# Altium project Hardware_Inventors_Course_Project.PrjPcb (part 1 of 2)
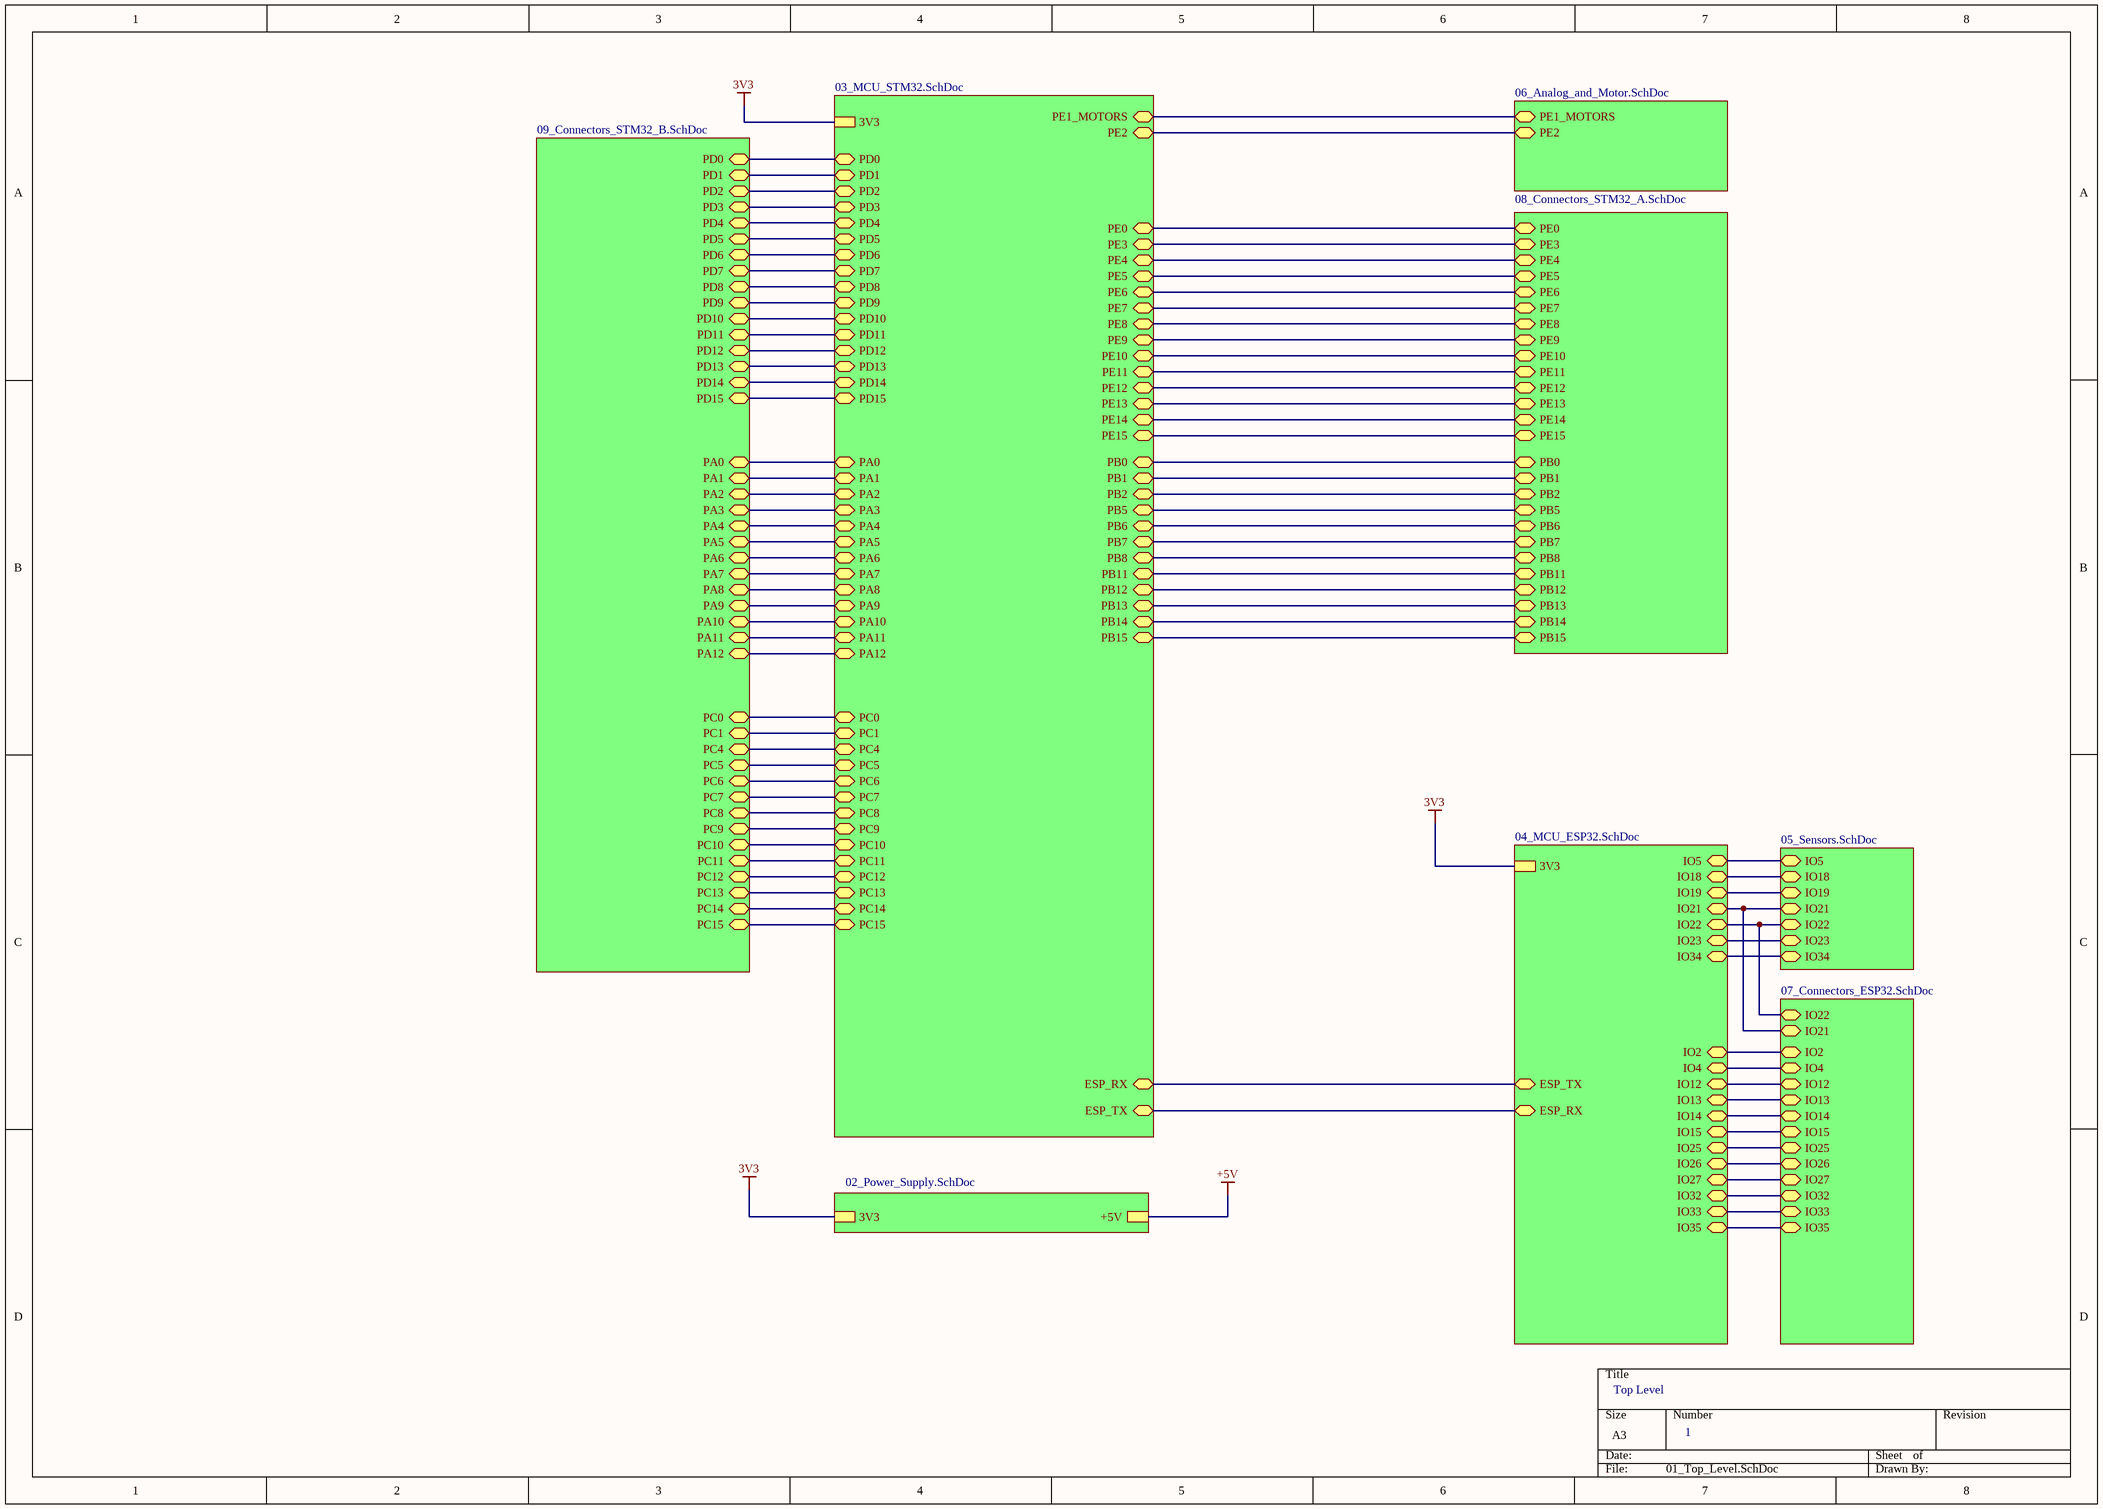
[diagram p0: 01_Top_Level.SchDoc]
9 sheets, 94 parts. Net scope: hierarchical (ports join the sheet entries above them; power ports are global).
Board file: Course_Project_PCB.PcbDoc
Sheets:
  01_Top_Level.SchDoc
    U_03_MCU_STM32 = 03_MCU_STM32.SchDoc
    U_02_Power_Supply = 02_Power_Supply.SchDoc
    U_04_MCU_ESP32 = 04_MCU_ESP32.SchDoc
    U_05_Sensors = 05_Sensors.SchDoc
    U_06_Analog_and_Motor = 06_Analog_and_Motor.SchDoc
    U_07_Connectors_ESP32 = 07_Connectors_ESP32.SchDoc
    U_08_Connectors_STM32_A = 08_Connectors_STM32_A.SchDoc
    U_09_Connectors_STM32_B = 09_Connectors_STM32_B.SchDoc

## Sheet 01_Top_Level.SchDoc
size A3; SheetNumber: 1; SheetTotal: 9

### Sub-sheets
U_02_Power_Supply = 02_Power_Supply.SchDoc: +5V, 3V3
U_03_MCU_STM32 = 03_MCU_STM32.SchDoc: 3V3, PE0 (bidir), PE1_MOTORS (bidir), PE2 (bidir), PE3 (bidir), PE4 (bidir), PE5 (bidir), PE6 (bidir), PE7 (bidir), PE8 (bidir), PE9 (bidir), PE10 (bidir), PE11 (bidir), PE12 (bidir), PE13 (bidir), PE14 (bidir), PE15 (bidir), PB15 (bidir), PB14 (bidir), PB13 (bidir), PB12 (bidir), PB11 (bidir), PB8 (bidir), PB7 (bidir), PB6 (bidir), PB5 (bidir), PB2 (bidir), PB1 (bidir), PB0 (bidir), PD1 (bidir), PD2 (bidir), PD3 (bidir), PD4 (bidir), PD5 (bidir), PD6 (bidir), PD7 (bidir), PD8 (bidir), PD9 (bidir), PD10 (bidir), PD11 (bidir), PD12 (bidir), PD13 (bidir), PD14 (bidir), PD15 (bidir), PD0 (bidir), PA0 (bidir), PA1 (bidir), PA2 (bidir), PA3 (bidir), PA4 (bidir), PA5 (bidir), PA6 (bidir), PA7 (bidir), PA8 (bidir), PA9 (bidir), PA10 (bidir), PA11 (bidir), PA12 (bidir), PC0 (bidir), PC1 (bidir), PC4 (bidir), PC5 (bidir), PC6 (bidir), PC7 (bidir), PC8 (bidir), PC9 (bidir), PC10 (bidir), PC11 (bidir), PC12 (bidir), PC13 (bidir), PC14 (bidir), PC15 (bidir), ESP_RX (bidir), ESP_TX (bidir)
U_04_MCU_ESP32 = 04_MCU_ESP32.SchDoc: IO2 (bidir), IO4 (bidir), IO5 (bidir), IO12 (bidir), IO13 (bidir), IO14 (bidir), IO15 (bidir), ESP_RX (bidir), ESP_TX (bidir), IO18 (bidir), IO19 (bidir), IO21 (bidir), IO22 (bidir), IO23 (bidir), IO25 (bidir), IO26 (bidir), IO27 (bidir), IO32 (bidir), IO33 (bidir), IO34 (bidir), IO35 (bidir), 3V3
U_05_Sensors = 05_Sensors.SchDoc: IO21 (bidir), IO22 (bidir), IO5 (bidir), IO18 (bidir), IO23 (bidir), IO19 (bidir), IO34 (bidir)
U_06_Analog_and_Motor = 06_Analog_and_Motor.SchDoc: PE1_MOTORS (bidir), PE2 (bidir)
U_07_Connectors_ESP32 = 07_Connectors_ESP32.SchDoc: IO22 (bidir), IO21 (bidir), IO2 (bidir), IO4 (bidir), IO12 (bidir), IO13 (bidir), IO14 (bidir), IO15 (bidir), IO25 (bidir), IO26 (bidir), IO27 (bidir), IO32 (bidir), IO33 (bidir), IO35 (bidir)
U_08_Connectors_STM32_A = 08_Connectors_STM32_A.SchDoc: PE0 (bidir), PE3 (bidir), PE4 (bidir), PE5 (bidir), PE6 (bidir), PE7 (bidir), PE8 (bidir), PE9 (bidir), PE10 (bidir), PE11 (bidir), PE12 (bidir), PE13 (bidir), PE14 (bidir), PE15 (bidir), PB0 (bidir), PB1 (bidir), PB2 (bidir), PB5 (bidir), PB6 (bidir), PB7 (bidir), PB8 (bidir), PB11 (bidir), PB12 (bidir), PB13 (bidir), PB14 (bidir), PB15 (bidir)
U_09_Connectors_STM32_B = 09_Connectors_STM32_B.SchDoc: PD0 (bidir), PD1 (bidir), PD2 (bidir), PD3 (bidir), PD4 (bidir), PD5 (bidir), PD6 (bidir), PD7 (bidir), PD8 (bidir), PD9 (bidir), PD10 (bidir), PD11 (bidir), PD12 (bidir), PD13 (bidir), PD14 (bidir), PD15 (bidir), PA0 (bidir), PA1 (bidir), PA2 (bidir), PA3 (bidir), PA4 (bidir), PA5 (bidir), PA6 (bidir), PA7 (bidir), PA8 (bidir), PA9 (bidir), PA10 (bidir), PA11 (bidir), PA12 (bidir), PC0 (bidir), PC1 (bidir), PC4 (bidir), PC6 (bidir), PC8 (bidir), PC5 (bidir), PC7 (bidir), PC9 (bidir), PC10 (bidir), PC11 (bidir), PC12 (bidir), PC13 (bidir), PC14 (bidir), PC15 (bidir)

### Nets
3V3: sheet U_03_MCU_STM32/3V3, sheet U_02_Power_Supply/3V3, sheet U_04_MCU_ESP32/3V3
PA0: sheet U_03_MCU_STM32/PA0, sheet U_09_Connectors_STM32_B/PA0
PA1: sheet U_03_MCU_STM32/PA1, sheet U_09_Connectors_STM32_B/PA1
PA2: sheet U_03_MCU_STM32/PA2, sheet U_03_MCU_STM32/ESP_RX, sheet U_04_MCU_ESP32/ESP_TX, sheet U_09_Connectors_STM32_B/PA2
PA3: sheet U_03_MCU_STM32/PA3, sheet U_03_MCU_STM32/ESP_TX, sheet U_04_MCU_ESP32/ESP_RX, sheet U_09_Connectors_STM32_B/PA3
PA4: sheet U_03_MCU_STM32/PA4, sheet U_09_Connectors_STM32_B/PA4
PA5: sheet U_03_MCU_STM32/PA5, sheet U_09_Connectors_STM32_B/PA5
PA6: sheet U_03_MCU_STM32/PA6, sheet U_09_Connectors_STM32_B/PA6
PA7: sheet U_03_MCU_STM32/PA7, sheet U_09_Connectors_STM32_B/PA7
PA8: sheet U_03_MCU_STM32/PA8, sheet U_09_Connectors_STM32_B/PA8
PA9: sheet U_03_MCU_STM32/PA9, sheet U_09_Connectors_STM32_B/PA9
PA10: sheet U_03_MCU_STM32/PA10, sheet U_09_Connectors_STM32_B/PA10
PA11: sheet U_03_MCU_STM32/PA11, sheet U_09_Connectors_STM32_B/PA11
PA12: sheet U_03_MCU_STM32/PA12, sheet U_09_Connectors_STM32_B/PA12
PB0: sheet U_03_MCU_STM32/PB0, sheet U_08_Connectors_STM32_A/PB0
PB1: sheet U_03_MCU_STM32/PB1, sheet U_08_Connectors_STM32_A/PB1
PB2: sheet U_03_MCU_STM32/PB2, sheet U_08_Connectors_STM32_A/PB2
PB5: sheet U_03_MCU_STM32/PB5, sheet U_08_Connectors_STM32_A/PB5
PB6: sheet U_03_MCU_STM32/PB6, sheet U_08_Connectors_STM32_A/PB6
PB7: sheet U_03_MCU_STM32/PB7, sheet U_08_Connectors_STM32_A/PB7
PB8: sheet U_03_MCU_STM32/PB8, sheet U_08_Connectors_STM32_A/PB8
PB11: sheet U_03_MCU_STM32/PB11, sheet U_08_Connectors_STM32_A/PB11
PB12: sheet U_03_MCU_STM32/PB12, sheet U_08_Connectors_STM32_A/PB12
PB13: sheet U_03_MCU_STM32/PB13, sheet U_08_Connectors_STM32_A/PB13
PB14: sheet U_03_MCU_STM32/PB14, sheet U_08_Connectors_STM32_A/PB14
PB15: sheet U_03_MCU_STM32/PB15, sheet U_08_Connectors_STM32_A/PB15
PC0: sheet U_03_MCU_STM32/PC0, sheet U_09_Connectors_STM32_B/PC0
PC1: sheet U_03_MCU_STM32/PC1, sheet U_09_Connectors_STM32_B/PC1
PC4: sheet U_03_MCU_STM32/PC4, sheet U_09_Connectors_STM32_B/PC4
PC5: sheet U_03_MCU_STM32/PC5, sheet U_09_Connectors_STM32_B/PC5
PC6: sheet U_03_MCU_STM32/PC6, sheet U_09_Connectors_STM32_B/PC6
PC7: sheet U_03_MCU_STM32/PC7, sheet U_09_Connectors_STM32_B/PC7
PC8: sheet U_03_MCU_STM32/PC8, sheet U_09_Connectors_STM32_B/PC8
PC9: sheet U_03_MCU_STM32/PC9, sheet U_09_Connectors_STM32_B/PC9
PC10: sheet U_03_MCU_STM32/PC10, sheet U_09_Connectors_STM32_B/PC10
PC11: sheet U_03_MCU_STM32/PC11, sheet U_09_Connectors_STM32_B/PC11
PC12: sheet U_03_MCU_STM32/PC12, sheet U_09_Connectors_STM32_B/PC12
PC13: sheet U_03_MCU_STM32/PC13, sheet U_09_Connectors_STM32_B/PC13
PC14: sheet U_03_MCU_STM32/PC14, sheet U_09_Connectors_STM32_B/PC14
PC15: sheet U_03_MCU_STM32/PC15, sheet U_09_Connectors_STM32_B/PC15
PD0: sheet U_03_MCU_STM32/PD0, sheet U_09_Connectors_STM32_B/PD0
PD1: sheet U_03_MCU_STM32/PD1, sheet U_09_Connectors_STM32_B/PD1
PD2: sheet U_03_MCU_STM32/PD2, sheet U_09_Connectors_STM32_B/PD2
PD3: sheet U_03_MCU_STM32/PD3, sheet U_09_Connectors_STM32_B/PD3
PD4: sheet U_03_MCU_STM32/PD4, sheet U_09_Connectors_STM32_B/PD4
PD5: sheet U_03_MCU_STM32/PD5, sheet U_09_Connectors_STM32_B/PD5
PD6: sheet U_03_MCU_STM32/PD6, sheet U_09_Connectors_STM32_B/PD6
PD7: sheet U_03_MCU_STM32/PD7, sheet U_09_Connectors_STM32_B/PD7
PD8: sheet U_03_MCU_STM32/PD8, sheet U_09_Connectors_STM32_B/PD8
PD9: sheet U_03_MCU_STM32/PD9, sheet U_09_Connectors_STM32_B/PD9
PD10: sheet U_03_MCU_STM32/PD10, sheet U_09_Connectors_STM32_B/PD10
PD11: sheet U_03_MCU_STM32/PD11, sheet U_09_Connectors_STM32_B/PD11
PD12: sheet U_03_MCU_STM32/PD12, sheet U_09_Connectors_STM32_B/PD12
PD13: sheet U_03_MCU_STM32/PD13, sheet U_09_Connectors_STM32_B/PD13
PD14: sheet U_03_MCU_STM32/PD14, sheet U_09_Connectors_STM32_B/PD14
PD15: sheet U_03_MCU_STM32/PD15, sheet U_09_Connectors_STM32_B/PD15
PE0: sheet U_03_MCU_STM32/PE0, sheet U_08_Connectors_STM32_A/PE0
PE1_MOTORS: sheet U_03_MCU_STM32/PE1_MOTORS, sheet U_06_Analog_and_Motor/PE1_MOTORS
PE2: sheet U_03_MCU_STM32/PE2, sheet U_06_Analog_and_Motor/PE2
PE3: sheet U_03_MCU_STM32/PE3, sheet U_08_Connectors_STM32_A/PE3
PE4: sheet U_03_MCU_STM32/PE4, sheet U_08_Connectors_STM32_A/PE4
PE5: sheet U_03_MCU_STM32/PE5, sheet U_08_Connectors_STM32_A/PE5
PE6: sheet U_03_MCU_STM32/PE6, sheet U_08_Connectors_STM32_A/PE6
PE7: sheet U_03_MCU_STM32/PE7, sheet U_08_Connectors_STM32_A/PE7
PE8: sheet U_03_MCU_STM32/PE8, sheet U_08_Connectors_STM32_A/PE8
PE9: sheet U_03_MCU_STM32/PE9, sheet U_08_Connectors_STM32_A/PE9
PE10: sheet U_03_MCU_STM32/PE10, sheet U_08_Connectors_STM32_A/PE10
PE11: sheet U_03_MCU_STM32/PE11, sheet U_08_Connectors_STM32_A/PE11
PE12: sheet U_03_MCU_STM32/PE12, sheet U_08_Connectors_STM32_A/PE12
PE13: sheet U_03_MCU_STM32/PE13, sheet U_08_Connectors_STM32_A/PE13
PE14: sheet U_03_MCU_STM32/PE14, sheet U_08_Connectors_STM32_A/PE14
PE15: sheet U_03_MCU_STM32/PE15, sheet U_08_Connectors_STM32_A/PE15
SCL: sheet U_04_MCU_ESP32/IO21, sheet U_05_Sensors/IO21, sheet U_07_Connectors_ESP32/IO21
SDA: sheet U_04_MCU_ESP32/IO22, sheet U_05_Sensors/IO22, sheet U_07_Connectors_ESP32/IO22
NetC31_2: sheet U_04_MCU_ESP32/IO34, sheet U_05_Sensors/IO34
NetJ3_3: sheet U_04_MCU_ESP32/IO2, sheet U_07_Connectors_ESP32/IO2
NetJ3_4: sheet U_04_MCU_ESP32/IO4, sheet U_07_Connectors_ESP32/IO4
NetJ3_5: sheet U_04_MCU_ESP32/IO12, sheet U_07_Connectors_ESP32/IO12
NetJ3_6: sheet U_04_MCU_ESP32/IO13, sheet U_07_Connectors_ESP32/IO13
NetJ3_7: sheet U_04_MCU_ESP32/IO14, sheet U_07_Connectors_ESP32/IO14
NetJ3_8: sheet U_04_MCU_ESP32/IO15, sheet U_07_Connectors_ESP32/IO15
NetJ3_9: sheet U_04_MCU_ESP32/IO25, sheet U_07_Connectors_ESP32/IO25
NetJ3_10: sheet U_04_MCU_ESP32/IO26, sheet U_07_Connectors_ESP32/IO26
NetJ3_11: sheet U_04_MCU_ESP32/IO27, sheet U_07_Connectors_ESP32/IO27
NetJ3_12: sheet U_04_MCU_ESP32/IO32, sheet U_07_Connectors_ESP32/IO32
NetJ3_13: sheet U_04_MCU_ESP32/IO33, sheet U_07_Connectors_ESP32/IO33
NetJ3_14: sheet U_04_MCU_ESP32/IO35, sheet U_07_Connectors_ESP32/IO35
NetMD1_29: sheet U_04_MCU_ESP32/IO5, sheet U_05_Sensors/IO5
NetMD1_30: sheet U_04_MCU_ESP32/IO18, sheet U_05_Sensors/IO18
NetMD1_31: sheet U_04_MCU_ESP32/IO19, sheet U_05_Sensors/IO19
NetMD1_37: sheet U_04_MCU_ESP32/IO23, sheet U_05_Sensors/IO23

### Notes on the sheet
- Top Level
- 1

## Sheet 03_MCU_STM32.SchDoc
size A3; SheetNumber: 3; SheetTotal: 9
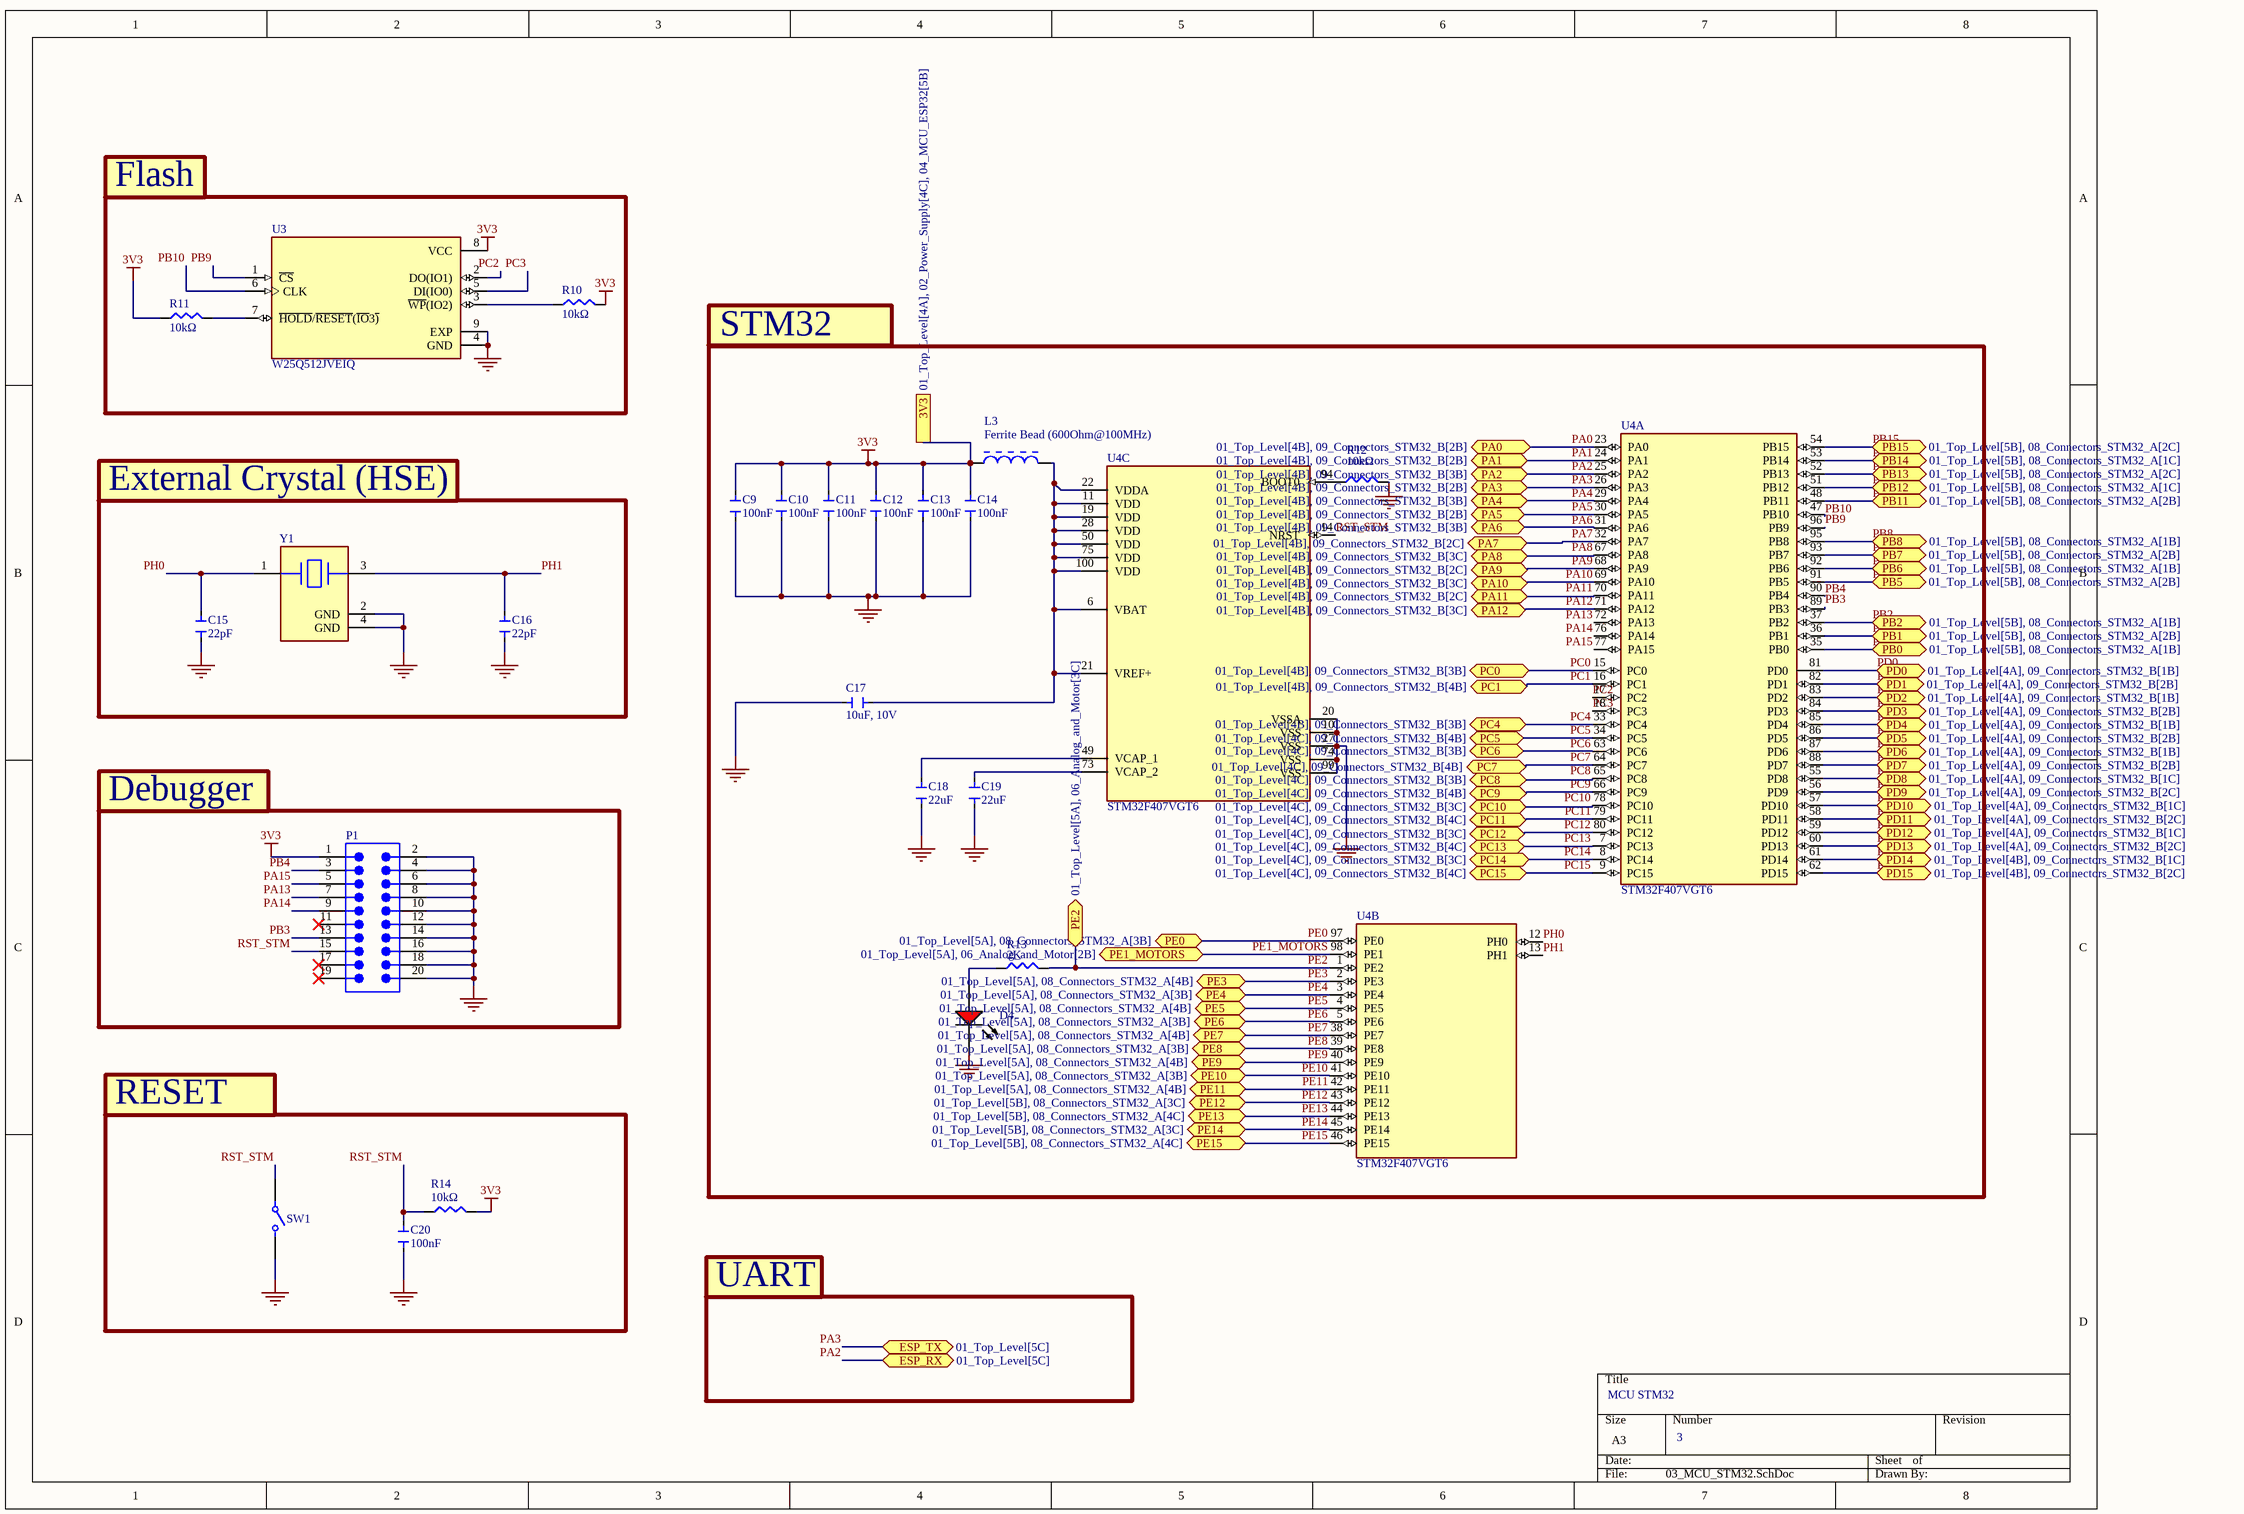
[diagram p1: 03_MCU_STM32.SchDoc]

### Parts
C9  100nF  [CAP_100nF]
C10  100nF  [CAP_100nF]
C11  100nF  [CAP_100nF]
C12  100nF  [CAP_100nF]
C13  100nF  [CAP_100nF]
C14  100nF  [CAP_100nF]
C15  22pF  [CAP_22uF]
C16  22pF  [CAP_22uF]
C17  10uF, 10V  [CAP_10uF]
C18  22uF  [CAP_22uF]
C19  22uF  [CAP_22uF]
C20  100nF  [CAP_100nF]
D4  304090041  [LED-2P-2.28-3MM_A]  (value not drawn)
L3  BLM18AG121SN1D  [MURA-BLM18-F-H1-CHIP-2_V]  (value not drawn)
P1  61002021121  [61002021121]  (value not drawn)
R10  10kΩ  [RES_10K]
R11  10kΩ  [RES_10K]
R12  10kΩ  [RES_10K]
R13  2K  [RES_2K]
R14  10kΩ  [RES_10K]
SW1  EVP-BD6C1A000  [FP-EVP-BD6C1A000-MFG]  (value not drawn)
U3  W25Q512JVEIQ  [SON127P600X800X80-9N]
U4  STM32F407VGT6  [QFP50P1600X1600X160-100N]  (parts A,B,C of 3)
Y1  ABM11AIG-32.000MHZ-4-T3  [FP-ABM11AIG-MFG]  (value not drawn)

### Blocks framed on the sheet
Flash: R10 R11 U3
STM32: C9-C14 C17-C19 D4 L3 R12 R13 U4
External Crystal (HSE): C15 C16 Y1
Debugger: P1
RESET: C20 R14 SW1

### Ports
3V3 (see 01_Top_Level[4A], 02_Power_Supply[4C], 04_MCU_ESP32[5B]), ESP_RX (bidir, see 01_Top_Level[5C]), ESP_TX (bidir, see 01_Top_Level[5C]), PA0 (bidir, see 01_Top_Level[4B], 09_Connectors_STM32_B[2B]), PA1 (bidir, see 01_Top_Level[4B], 09_Connectors_STM32_B[2B]), PA2 (bidir, see 01_Top_Level[4B], 09_Connectors_STM32_B[3B]), PA3 (bidir, see 01_Top_Level[4B], 09_Connectors_STM32_B[2B]), PA4 (bidir, see 01_Top_Level[4B], 09_Connectors_STM32_B[3B]), PA5 (bidir, see 01_Top_Level[4B], 09_Connectors_STM32_B[2B]), PA6 (bidir, see 01_Top_Level[4B], 09_Connectors_STM32_B[3B]), PA7 (bidir, see 01_Top_Level[4B], 09_Connectors_STM32_B[2C]), PA8 (bidir, see 01_Top_Level[4B], 09_Connectors_STM32_B[3C]), PA9 (bidir, see 01_Top_Level[4B], 09_Connectors_STM32_B[2C]), PA10 (bidir, see 01_Top_Level[4B], 09_Connectors_STM32_B[3C]), PA11 (bidir, see 01_Top_Level[4B], 09_Connectors_STM32_B[2C]), PA12 (bidir, see 01_Top_Level[4B], 09_Connectors_STM32_B[3C]), PB0 (bidir, see 01_Top_Level[5B], 08_Connectors_STM32_A[1B]), PB1 (bidir, see 01_Top_Level[5B], 08_Connectors_STM32_A[2B]), PB2 (bidir, see 01_Top_Level[5B], 08_Connectors_STM32_A[1B]), PB5 (bidir, see 01_Top_Level[5B], 08_Connectors_STM32_A[2B]), PB6 (bidir, see 01_Top_Level[5B], 08_Connectors_STM32_A[1B]), PB7 (bidir, see 01_Top_Level[5B], 08_Connectors_STM32_A[2B]), PB8 (bidir, see 01_Top_Level[5B], 08_Connectors_STM32_A[1B]), PB11 (bidir, see 01_Top_Level[5B], 08_Connectors_STM32_A[2B]), PB12 (bidir, see 01_Top_Level[5B], 08_Connectors_STM32_A[1C]), PB13 (bidir, see 01_Top_Level[5B], 08_Connectors_STM32_A[2C]), PB14 (bidir, see 01_Top_Level[5B], 08_Connectors_STM32_A[1C]), PB15 (bidir, see 01_Top_Level[5B], 08_Connectors_STM32_A[2C]), PC0 (bidir, see 01_Top_Level[4B], 09_Connectors_STM32_B[3B]), PC1 (bidir, see 01_Top_Level[4B], 09_Connectors_STM32_B[4B]), PC4 (bidir, see 01_Top_Level[4B], 09_Connectors_STM32_B[3B]), PC5 (bidir, see 01_Top_Level[4C], 09_Connectors_STM32_B[4B]), PC6 (bidir, see 01_Top_Level[4C], 09_Connectors_STM32_B[3B]), PC7 (bidir, see 01_Top_Level[4C], 09_Connectors_STM32_B[4B]), PC8 (bidir, see 01_Top_Level[4C], 09_Connectors_STM32_B[3B]), PC9 (bidir, see 01_Top_Level[4C], 09_Connectors_STM32_B[4B]), PC10 (bidir, see 01_Top_Level[4C], 09_Connectors_STM32_B[3C]), PC11 (bidir, see 01_Top_Level[4C], 09_Connectors_STM32_B[4C]), PC12 (bidir, see 01_Top_Level[4C], 09_Connectors_STM32_B[3C]), PC13 (bidir, see 01_Top_Level[4C], 09_Connectors_STM32_B[4C]), PC14 (bidir, see 01_Top_Level[4C], 09_Connectors_STM32_B[3C]), PC15 (bidir, see 01_Top_Level[4C], 09_Connectors_STM32_B[4C]), PD0 (bidir, see 01_Top_Level[4A], 09_Connectors_STM32_B[1B]), PD1 (bidir, see 01_Top_Level[4A], 09_Connectors_STM32_B[2B]), PD2 (bidir, see 01_Top_Level[4A], 09_Connectors_STM32_B[1B]), PD3 (bidir, see 01_Top_Level[4A], 09_Connectors_STM32_B[2B]), PD4 (bidir, see 01_Top_Level[4A], 09_Connectors_STM32_B[1B]), PD5 (bidir, see 01_Top_Level[4A], 09_Connectors_STM32_B[2B]), PD6 (bidir, see 01_Top_Level[4A], 09_Connectors_STM32_B[1B]), PD7 (bidir, see 01_Top_Level[4A], 09_Connectors_STM32_B[2B]), PD8 (bidir, see 01_Top_Level[4A], 09_Connectors_STM32_B[1C]), PD9 (bidir, see 01_Top_Level[4A], 09_Connectors_STM32_B[2C]), PD10 (bidir, see 01_Top_Level[4A], 09_Connectors_STM32_B[1C]), PD11 (bidir, see 01_Top_Level[4A], 09_Connectors_STM32_B[2C]), PD12 (bidir, see 01_Top_Level[4A], 09_Connectors_STM32_B[1C]), PD13 (bidir, see 01_Top_Level[4A], 09_Connectors_STM32_B[2C]), PD14 (bidir, see 01_Top_Level[4B], 09_Connectors_STM32_B[1C]), PD15 (bidir, see 01_Top_Level[4B], 09_Connectors_STM32_B[2C]), PE0 (bidir, see 01_Top_Level[5A], 08_Connectors_STM32_A[3B]), PE1_MOTORS (bidir, see 01_Top_Level[5A], 06_Analog_and_Motor[2B]), PE2 (bidir, see 01_Top_Level[5A], 06_Analog_and_Motor[3C]), PE3 (bidir, see 01_Top_Level[5A], 08_Connectors_STM32_A[4B]), PE4 (bidir, see 01_Top_Level[5A], 08_Connectors_STM32_A[3B]), PE5 (bidir, see 01_Top_Level[5A], 08_Connectors_STM32_A[4B]), PE6 (bidir, see 01_Top_Level[5A], 08_Connectors_STM32_A[3B]), PE7 (bidir, see 01_Top_Level[5A], 08_Connectors_STM32_A[4B]), PE8 (bidir, see 01_Top_Level[5A], 08_Connectors_STM32_A[3B]), PE9 (bidir, see 01_Top_Level[5A], 08_Connectors_STM32_A[4B]), PE10 (bidir, see 01_Top_Level[5A], 08_Connectors_STM32_A[3B]), PE11 (bidir, see 01_Top_Level[5A], 08_Connectors_STM32_A[4B]), PE12 (bidir, see 01_Top_Level[5B], 08_Connectors_STM32_A[3C]), PE13 (bidir, see 01_Top_Level[5B], 08_Connectors_STM32_A[4C]), PE14 (bidir, see 01_Top_Level[5B], 08_Connectors_STM32_A[3C]), PE15 (bidir, see 01_Top_Level[5B], 08_Connectors_STM32_A[4C])

### Nets
3V3: C9.2 C10.2 C11.2 C12.2 C13.2 C14.2 L3.1 P1.1 R10.2 R11.1 R14.2 U3.8(VCC) ; port 3V3
GND: C9.1 C10.1 C11.1 C12.1 C13.1 C14.1 C15.1 C16.1 C17.1 C18.2 C19.2 C20.1 D4.2(K) P1.2 P1.4 P1.6 P1.8 P1.10 P1.12 P1.14 P1.16 P1.18 P1.20 R12.2 SW1.B U3.4(GND) U3.9(EXP) U4.10(VSS) U4.20(VSSA) U4.27(VSS) U4.74(VSS) U4.99(VSS) Y1.2(GND) Y1.4(GND)
PA0: U4.23(PA0) ; port PA0
PA1: U4.24(PA1) ; port PA1
PA2: U4.25(PA2) ; port PA2, port ESP_RX
PA3: U4.26(PA3) ; port PA3, port ESP_TX
PA4: U4.29(PA4) ; port PA4
PA5: U4.30(PA5) ; port PA5
PA6: U4.31(PA6) ; port PA6
PA7: U4.32(PA7) ; port PA7
PA8: U4.67(PA8) ; port PA8
PA9: U4.68(PA9) ; port PA9
PA10: U4.69(PA10) ; port PA10
PA11: U4.70(PA11) ; port PA11
PA12: U4.71(PA12) ; port PA12
PA13: P1.7 U4.72(PA13)
PA14: P1.9 U4.76(PA14)
PA15: P1.5 U4.77(PA15)
PB0: U4.35(PB0) ; port PB0
PB1: U4.36(PB1) ; port PB1
PB2: U4.37(PB2) ; port PB2
PB3: P1.13 U4.89(PB3)
PB4: P1.3 U4.90(PB4)
PB5: U4.91(PB5) ; port PB5
PB6: U4.92(PB6) ; port PB6
PB7: U4.93(PB7) ; port PB7
PB8: U4.95(PB8) ; port PB8
PB9: U3.1(~{CS}) U4.96(PB9)
PB10: U3.6(CLK) U4.47(PB10)
PB11: U4.48(PB11) ; port PB11
PB12: U4.51(PB12) ; port PB12
PB13: U4.52(PB13) ; port PB13
PB14: U4.53(PB14) ; port PB14
PB15: U4.54(PB15) ; port PB15
PC0: U4.15(PC0) ; port PC0
PC1: U4.16(PC1) ; port PC1
PC2: U3.2(DO(IO1)) U4.17(PC2)
PC3: U3.5(DI(IO0)) U4.18(PC3)
PC4: U4.33(PC4) ; port PC4
PC5: U4.34(PC5) ; port PC5
PC6: U4.63(PC6) ; port PC6
PC7: U4.64(PC7) ; port PC7
PC8: U4.65(PC8) ; port PC8
PC9: U4.66(PC9) ; port PC9
PC10: U4.78(PC10) ; port PC10
PC11: U4.79(PC11) ; port PC11
PC12: U4.80(PC12) ; port PC12
PC13: U4.7(PC13) ; port PC13
PC14: U4.8(PC14) ; port PC14
PC15: U4.9(PC15) ; port PC15
PD0: U4.81(PD0) ; port PD0
PD1: U4.82(PD1) ; port PD1
PD2: U4.83(PD2) ; port PD2
PD3: U4.84(PD3) ; port PD3
PD4: U4.85(PD4) ; port PD4
PD5: U4.86(PD5) ; port PD5
PD6: U4.87(PD6) ; port PD6
PD7: U4.88(PD7) ; port PD7
PD8: U4.55(PD8) ; port PD8
PD9: U4.56(PD9) ; port PD9
PD10: U4.57(PD10) ; port PD10
PD11: U4.58(PD11) ; port PD11
PD12: U4.59(PD12) ; port PD12
PD13: U4.60(PD13) ; port PD13
PD14: U4.61(PD14) ; port PD14
PD15: U4.62(PD15) ; port PD15
PE0: U4.97(PE0) ; port PE0
PE1_MOTORS: U4.98(PE1) ; port PE1_MOTORS
PE2: R13.2 U4.1(PE2) ; port PE2
PE3: U4.2(PE3) ; port PE3
PE4: U4.3(PE4) ; port PE4
PE5: U4.4(PE5) ; port PE5
PE6: U4.5(PE6) ; port PE6
PE7: U4.38(PE7) ; port PE7
PE8: U4.39(PE8) ; port PE8
PE9: U4.40(PE9) ; port PE9
PE10: U4.41(PE10) ; port PE10
PE11: U4.42(PE11) ; port PE11
PE12: U4.43(PE12) ; port PE12
PE13: U4.44(PE13) ; port PE13
PE14: U4.45(PE14) ; port PE14
PE15: U4.46(PE15) ; port PE15
PH0: C15.2 U4.12(PH0) Y1.1(1_Crystal)
PH1: C16.2 U4.13(PH1) Y1.3(2_Crystal)
RST_STM: C20.2 P1.15 R14.1 SW1.A U4.14(NRST)
NetC17_2: C17.2 L3.2 U4.6(VBAT) U4.11(VDD) U4.19(VDD) U4.21(VREF+) U4.22(VDDA) U4.28(VDD) U4.50(VDD) U4.75(VDD) U4.100(VDD)
NetC18_1: C18.1 U4.49(VCAP_1)
NetC19_1: C19.1 U4.73(VCAP_2)
NetD4_1: D4.1(A) R13.1
NetR10_1: R10.1 U3.3(~{WP}(IO2))
NetR11_2: R11.2 U3.7(~{HOLD}/~{RESET}(~{IO}3~{)})
NetR12_1: R12.1 U4.94(BOOT0)

Not connected (* = marked no-connect by the designer): P1 11* 17* 19*

### Notes on the sheet
- (near L3) Ferrite Bead (600Ohm@100MHz)
- UART
- MCU STM32
- 3

### Library data of the parts
C9-C14 C20 = CAP_100nF: CAP 100nF 50V X7R ±10% 0603 Ceramic Capacitors RoHS; manufacturer: YAGEO; manufacturer part number: CC0603KRX7R9BB104; value: 100nf; supplier: LCSC; supplier part number: C14663; ComponentLink1Description: Datasheet; ComponentLink1URL: https://www.lcsc.com/datasheet/C14663.pdf
C15 C16 C18 C19 = CAP_22uF: CAP 22uF 25V X5R ±20% 0805 Ceramic Capacitors RoHS; manufacturer: Samsung Electro-Mechanics; manufacturer part number: CL21A226MAYNNNE; ComponentLink1Description: Datasheet; ComponentLink1URL: https://www.lcsc.com/datasheet/C602037.pdf; Value: 22uF; supplier: LCSC; supplier part number: C602037
C17 = CAP_0402_10UF: CAP CER 10UF 10V X5R 0402; Manufacturer: Samsung Electro-Mechanics; Manufacturer Part Number: C307415; Dielectric Material: Ceramic; Multilayer: Yes; Tolerance  (fill in as +-): 20%; Supplier: LCSC; Supplier Part Number: 1276-6830-1-ND; RoHS: Yes; Category: Ceramic Capacitors; Stock: 1294909; Pricing: 1=0.33, 10=0.215, 50=0.1584, 100=0.129, 500=0.1018, 1000=0.08597, 2500=0.08145 (USD); Mounting Technology: Surface Mount; Pins: 2; Package Shape: Rectangular; Case/Package: 0402; Terminal Finish: Nickel; Min Operating Temperature: -55°C; Max Operating Temperature: 85°C; JESD-609 Code: e3; Value: 10uF; Capacitor Type: Ceramic; Packaging: Tape and Reel; Tolerance (fill in as +-): 20%; Rated DC Voltage (URdc): 10V; Temperature Characteristics Code: X5R; Termination: Wraparound; Reach SVHC Compliant: Yes; RoHS Compliant: Yes; ComponentLink1URL: https://datasheet.ciiva.com:443/pdfs/VipMasterIC/IC/SEMS/SEMS-S-A0008521219/SEMS-S-A0008521325-1.pdf?src-supplier=IHS+Markit; ComponentLink1Description: https://datasheet.ciiva.com:443/pdfs/VipMasterIC/IC/SEMS/SEMS-S-A0008521219/SEMS-S-A0008521325-1.pdf?src-supplier=IHS+Markit; ComponentLink2URL: http://www.samsungsem.com/kr/support/product-search/mlcc/CL05A106MP8NUB8.jsp?src-supplier=Digikey; ComponentLink2Description: http://www.samsungsem.com/kr/support/product-search/mlcc/CL05A106MP8NUB8.jsp?src-supplier=Digikey; ComponentLink3URL: https://datasheet.octopart.com/CL05A106MP8NUB8-Samsung-Electro-Mechanics-datasheet-136460857.pdf?src-supplier=Future+Electronics; ComponentLink3Description: https://datasheet.octopart.com/CL05A106MP8NUB8-Samsung-Electro-Mechanics-datasheet-136460857.pdf?src-supplier=Future+Electronics; LCSC Part Number: C307415
D4 = CMP-007-00007-2: Red LED, 80 mW, 30 mA, -25 to 85 degC, 2-Pin THD; Manufacturer: Shenzhen CGX; Package Description: 2-Pin Through Hole Device, Dia 3 mm, Pitch 2.28 mm; Datasheet URL: http://datasheet.octopart.com/304090041-Chengguangxing-datasheet-62330656.pdf; Mounting Technology: TH; Manufacturer URL: http://szcgx.com/; RoHS Compliant: Unknown; Datasheet Version: Sep-14; Case/Package: 304090041; Package Reference: 304090041
L3 = CMP-006-00004-3: Chip Ferrite Bead for General Use, 120 Ohm, 500 mA, -55 to 125 degC, 0603 (1608 Metric), RoHS, Tape and Reel; Manufacturer: Murata; Max Current Rating: 500mA; Tolerance: 25%; Impedance: 120Ohm; Resistance: 200mohm; Min Operating Temperature: -55°C; Package Reference: BLM18_H950-2; Max Operating Temperature: 125°C; Current Rating: 500mA; Core Material: Ferrite; Datasheet Version: Jun-12; Packaging: TapeandReel; Datasheet URL: https://statics3.seeedstudio.com/images/opl/datasheet/303010016.pdf; Package Quantity: 4000; Case/Package: 0603; RoHS Compliant: True
P1 = CMP-1502-01036-4: SMT Vertical Pin Header WR-PHD, Pitch 2.54 mm, Dual Row, 20 pins; Number of Positions: 20; Connector Type: Male Pin; Row Spacing: 2.54mm; Voltage Rating: 250V; Contact Resistance: 20mΩ; Current Rating: 3A; Gender: Male; Mount: Surface Mount; Max Operating Temperature: 105°C; Number of Rows: 2; Orientation: Vertical; Contact Plating: Gold; Lead Pitch: 2.54mm; Pitch: 2.54mm; Min Operating Temperature: -40°C; RoHS: Compliant; Color: Black; Operating Supply Voltage: 250V; Termination: Solder; Number of Contacts: 20; Contact Mating Length: 5.9944mm; Height: 10mm; Number of Pins: 20; Contact Material: Gold
R10-R12 R14 = RES_0603_10K: 100mW Thin Film Resistor ±0.1% ±10ppm/℃ 10kΩ 0603 Chip Resistor - Surface Mount ROHS; Manufacturer: Yageo Group; Manufacturer Part Number: RT0603BRB07169KL; Manufacturer: YAGEO; Temperature Coefficient: 10ppm/°C; Voltage Rating: 75V; Features: Moisture Resistant; Height: 450µm; Length: 1.6002mm; Lifecycle Status: Production; Max Operating Temperature: 155°C; Max Power Dissipation: 100mW; Min Operating Temperature: -55°C; Mounting Technology: Surface Mount; Number of Terminals: 2; Number of Terminations: 2; Packaging: Tape & Reel; Power Dissipation: 100mW; Power Rating: 100mW; REACH SVHC: Yes; Tolerance: 0.1%; Width: 800µm; Working Voltage: 75V; ComponentLink1URL: https://datasheet.octopart.com:443/RT0603BRB07169KL-Yageo-datasheet-176402239.pdf?src-supplier=IHS; ComponentLink1Description: https://datasheet.octopart.com:443/RT0603BRB07169KL-Yageo-datasheet-176402239.pdf?src-supplier=IHS; ComponentLink2URL: https://datasheet.octopart.com:443/RT0603BRB07169KL-Yageo-datasheet-96443642.pdf?src-supplier=Upverter; ComponentLink2Description: https://datasheet.octopart.com:443/RT0603BRB07169KL-Yageo-datasheet-96443642.pdf?src-supplier=Upverter; ComponentLink3URL: https://datasheet.octopart.com:443/RT0603BRB07169KL-Yageo-Group-datasheet-141265893.pdf?src-supplier=ODG+(Origin+Data+Global); ComponentLink3Description: https://datasheet.octopart.com:443/RT0603BRB07169KL-Yageo-Group-datasheet-141265893.pdf?src-supplier=ODG+(Origin+Data+Global); ComponentLink4URL: https://datasheet.octopart.com/RT0603BRB07169KL-Yageo-datasheet-86813807.pdf; ComponentLink4Description: https://datasheet.octopart.com/RT0603BRB07169KL-Yageo-datasheet-86813807.pdf; ComponentLink5URL: http://sigma.octopart.com:80/conflict_mineral_statement/Yageo-company-3.pdf?src-supplier=Compliance+Statements; ComponentLink5Description: http://sigma.octopart.com:80/conflict_mineral_statement/Yageo-company-3.pdf?src-supplier=Compliance+Statements; ComponentLink6URL: http://sigma.octopart.com:80/rohs_statement/Yageo-company-2.pdf?src-supplier=Compliance+Statements; ComponentLink6Description: http://sigma.octopart.com:80/rohs_statement/Yageo-company-2.pdf?src-supplier=Compliance+Statements; Supplier: LCSC; Supplier Part Number: C860143; Datasheet Link: https://www.lcsc.com/datasheet/C860143.pdf
R13 = RSE_0603_2K: 100mW 2KΩ 75V Thick Film Resistor ±100ppm/℃ ±1% 0603 Chip Resistor - Surface Mount RoHS; ComponentLink1Description: datasheet; ComponentLink1URL: https://www.lcsc.com/product-detail/C105588.html?s_z=n_resistance%2520100%2520ohm
SW1 = CMP-00287-74573419-1: EVP-BD6C1A000 Switch Tactile N.O. SPST Round Button J-Bend 0.05A 12VDC 3.5N SMD Automotive T/R; Contact Current Rating: 20mA; Life (Cycles): 100kcycles; Contact Resistance: 500mΩ; Voltage Rating (DC): 15V; Number of Positions: 2; Max Operating Temperature: 90°C; NexarPartId: 74573419; RoHS: Non-Compliant; Min Operating Temperature: -40°C; Height: 4.2mm; Operating Force: 3.5N; Mount: Surface Mount
U3 = W25Q512JVEIQ: FLASH - NOR Memory IC 512Mb (64M x 8) SPI - Quad I/O 133 MHz 8-WSON (8x6); MF: Winbond Electronics; SnapEDA_Link: https://www.snapeda.com/parts/W25Q512JVEIQ/Winbond/view-part/?ref=snap; Package: Package; Value: *; MP: W25Q512JVEIQ; Check_prices: https://www.snapeda.com/parts/W25Q512JVEIQ/Winbond/view-part/?ref=eda
U4 = STM32F407VGT6: ARMÂ® CortexÂ®-M4 STM32F4 Microcontroller IC 32-Bit Single-Core 168MHz 1MB (1M x 8) FLASH 100-LQFP (14x14); MF: STMicroelectronics; SnapEDA_Link: https://www.snapeda.com/parts/STM32F407VGT6/STMicroelectronics/view-part/?ref=snap; Package: LQFP-100 STMicroelectronics; Value: *; MP: STM32F407VGT6; Check_prices: https://www.snapeda.com/parts/STM32F407VGT6/STMicroelectronics/view-part/?ref=eda
Y1 = CMP-27762-011048-1: Crystal 32MHz ±30ppm 10pF SMD-4 2.5mm x 2mm Automotive; Frequency Stability: 100ppm; ESR (Equivalent Series Resistance): 80R; Max Operating Temperature: 125°C; Frequency Tolerance: 30ppm; Length: 0.098inch; Frequency: 32MHz; RoHS Compliant: Yes; Min Operating Temperature: -40°C; Width: 0.079inch; Load Capacitance: 10pF; Packaging: Tape and Reel; Height: 0.024inch; Mount: Surface Mount; Case/Package: SMD/SMT; Ratings: AEC-Q200

## Sheet 02_Power_Supply.SchDoc
size A4; SheetNumber: 2; SheetTotal: 9
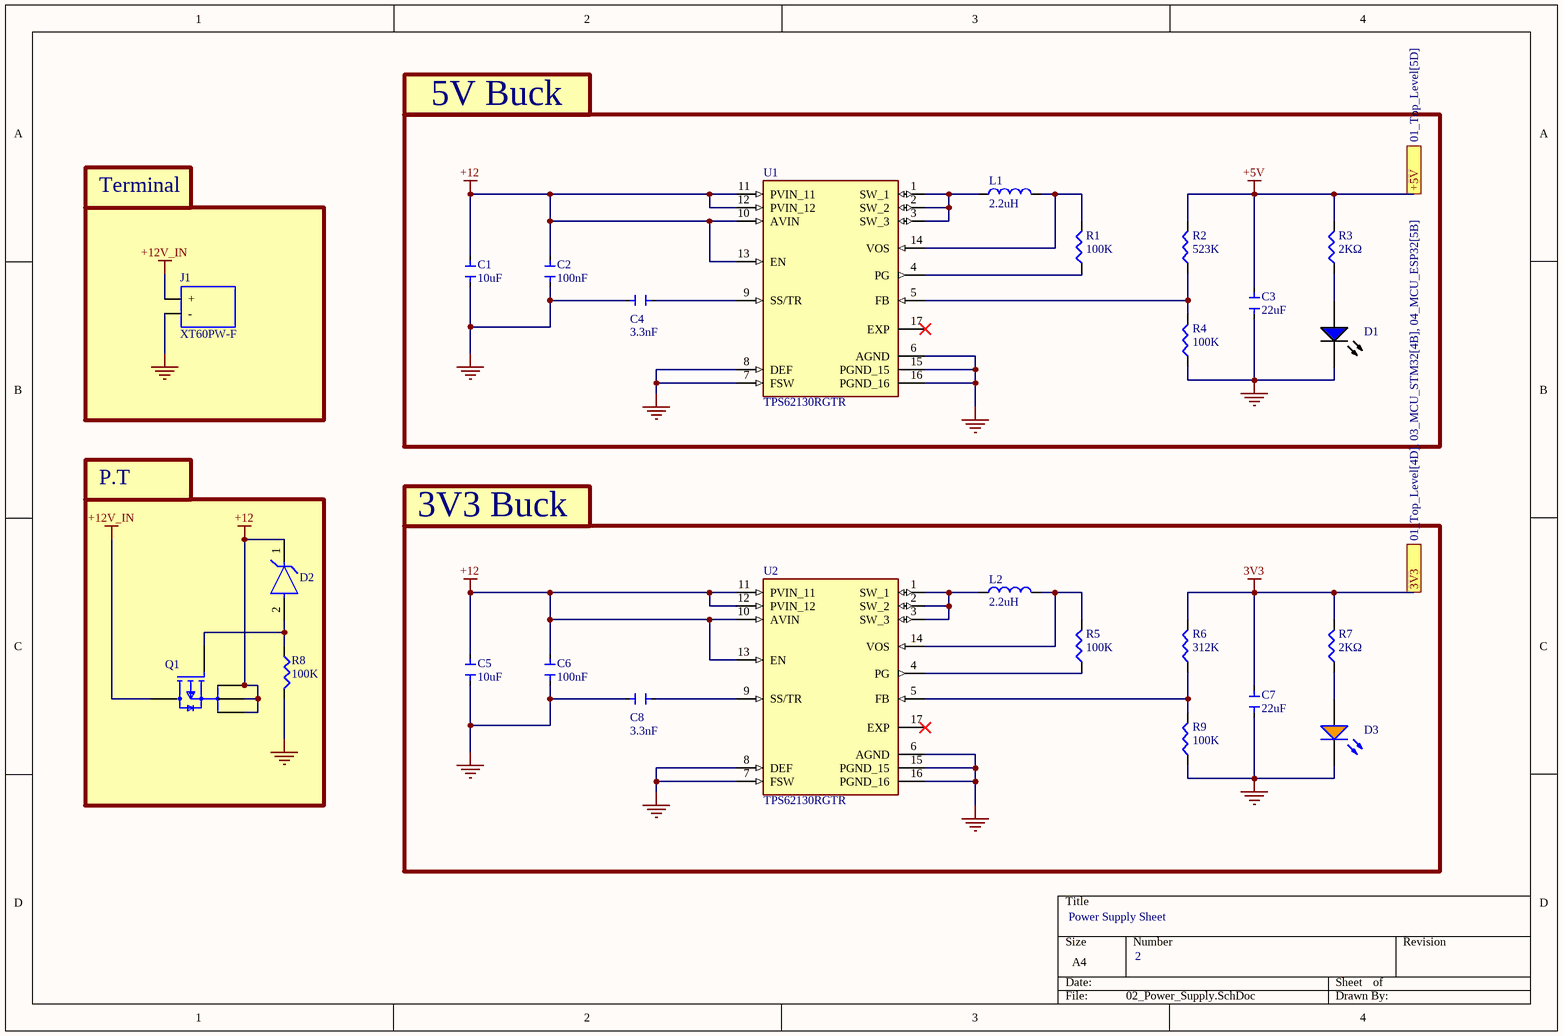
[diagram p2: 02_Power_Supply.SchDoc]

### Parts
C1  10uF  [CAP_10uF]
C2  100nF  [CAP_100nF]
C3  22uF  [CAP_22uF]
C4  3.3nF  [CAP_0603_0.33uF]
C5  10uF  [CAP_10uF]
C6  100nF  [CAP_100nF]
C7  22uF  [CAP_22uF]
C8  3.3nF  [CAP_0603_0.33uF]
D1  HSMR-C190  [AVAG-HSMX-C190_V]  (value not drawn)
D2  SMAZ15-13-F  [FP-SMA-MFG]  (value not drawn)
D3  HSMD-C190  [AVAG-HSMX-C190_V]  (value not drawn)
J1  XT60PW-F  [XT60PW-F]
L1  2.2uH  [IND_2.2uH]
L2  2.2uH  [IND_2.2uH]
Q1  SQJ431AEP-T1_GE3  [FP-S19-0643-SINGLE-MFG]  (value not drawn)
R1  100K  [RES_100K]
R2  523K  [RES_523K]
R3  2KΩ  [RES_312K]
R4  100K  [RES_100K]
R5  100K  [RES_100K]
R6  312K  [RES_523K]
R7  2KΩ  [RES_312K]
R8  100K  [RES_100K]
R9  100K  [RES_100K]
U1  TPS62130RGTR  [QFN50P300X300X100-17N]
U2  TPS62130RGTR  [QFN50P300X300X100-17N]

### Blocks framed on the sheet
5V Buck: C1-C4 D1 L1 R1-R4 U1
Terminal: J1
P.T: D2 Q1 R8
3V3 Buck: C5-C8 D3 L2 R5-R7 R9 U2

### Ports
3V3 (see 01_Top_Level[4D], 03_MCU_STM32[4B], 04_MCU_ESP32[5B]), +5V (see 01_Top_Level[5D])

### Nets
3V3: C7.2 R6.2 R7.2 ; port 3V3
+5V: C3.2 R2.2 R3.2 ; port +5V
+12: C1.2 C2.2 C5.2 C6.2 D2.1(C) Q1.1(S) Q1.2(S) Q1.3(S) U1.10(AVIN) U1.11(PVIN_11) U1.12(PVIN_12) U1.13(EN) U2.10(AVIN) U2.11(PVIN_11) U2.12(PVIN_12) U2.13(EN)
+12V_IN: J1.1(+) Q1.5-6-7-8(D)
GND: C1.1 C2.1 C3.1 C4.2 C5.1 C6.1 C7.1 C8.2 D1.2(K) D3.2(K) J1.2(-) R4.1 R8.2 R9.1 U1.6(AGND) U1.7(FSW) U1.8(DEF) U1.15(PGND_15) U1.16(PGND_16) U2.6(AGND) U2.7(FSW) U2.8(DEF) U2.15(PGND_15) U2.16(PGND_16)
NetC4_1: C4.1 U1.9(SS/TR)
NetC8_1: C8.1 U2.9(SS/TR)
NetD1_1: D1.1(A) R3.1
NetD2_2: D2.2(A) Q1.4(G) R8.1
NetD3_1: D3.1(A) R7.1
NetL1_1: L1.1 U1.1(SW_1) U1.2(SW_2) U1.3(SW_3)
NetL1_2: L1.2 R1.2 U1.14(VOS)
NetL2_1: L2.1 U2.1(SW_1) U2.2(SW_2) U2.3(SW_3)
NetL2_2: L2.2 R5.2 U2.14(VOS)
NetR1_1: R1.1 U1.4(PG)
NetR2_1: R2.1 R4.2 U1.5(FB)
NetR5_1: R5.1 U2.4(PG)
NetR6_1: R6.1 R9.2 U2.5(FB)

Not connected (* = marked no-connect by the designer): U1 17(EXP)*; U2 17(EXP)*

### Notes on the sheet
- Power Supply Sheet
- 2

### Library data of the parts
C1 C5 = CAP_0402_10UF: as C17 on sheet 03_MCU_STM32; Supplier: LCSC; Supplier Part Number: 1276-6830-1-ND; RoHS: Yes; Category: Ceramic Capacitors; Stock: 1294909; Pricing: 1=0.33, 10=0.215, 50=0.1584, 100=0.129, 500=0.1018, 1000=0.08597, 2500=0.08145 (USD); Mounting Technology: Surface Mount; Pins: 2; Package Shape: Rectangular; Case/Package: 0402; Terminal Finish: Nickel; Min Operating Temperature: -55°C; Max Operating Temperature: 85°C; JESD-609 Code: e3; Value: 10uF; Capacitor Type: Ceramic; Packaging: Tape and Reel; Tolerance (fill in as +-): 20%; Rated DC Voltage (URdc): 10V; Temperature Characteristics Code: X5R; Termination: Wraparound; Reach SVHC Compliant: Yes; RoHS Compliant: Yes; ComponentLink1URL: https://datasheet.ciiva.com:443/pdfs/VipMasterIC/IC/SEMS/SEMS-S-A0008521219/SEMS-S-A0008521325-1.pdf?src-supplier=IHS+Markit; ComponentLink1Description: https://datasheet.ciiva.com:443/pdfs/VipMasterIC/IC/SEMS/SEMS-S-A0008521219/SEMS-S-A0008521325-1.pdf?src-supplier=IHS+Markit; ComponentLink2URL: http://www.samsungsem.com/kr/support/product-search/mlcc/CL05A106MP8NUB8.jsp?src-supplier=Digikey; ComponentLink2Description: http://www.samsungsem.com/kr/support/product-search/mlcc/CL05A106MP8NUB8.jsp?src-supplier=Digikey; ComponentLink3URL: https://datasheet.octopart.com/CL05A106MP8NUB8-Samsung-Electro-Mechanics-datasheet-136460857.pdf?src-supplier=Future+Electronics; ComponentLink3Description: https://datasheet.octopart.com/CL05A106MP8NUB8-Samsung-Electro-Mechanics-datasheet-136460857.pdf?src-supplier=Future+Electronics; LCSC Part Number: C307415
C2 C6 = CAP_100nF: as C9 on sheet 03_MCU_STM32; value: 100nf; supplier: LCSC; supplier part number: C14663; ComponentLink1Description: Datasheet; ComponentLink1URL: https://www.lcsc.com/datasheet/C14663.pdf
C3 C7 = CAP_22uF: as C15 on sheet 03_MCU_STM32; ComponentLink1Description: Datasheet; ComponentLink1URL: https://www.lcsc.com/datasheet/C602037.pdf; Value: 22uF; supplier: LCSC; supplier part number: C602037
C4 C8 = CAP_0603_0.33uF
D1 = CMP-007-00015-2: LED Uni-Color Blue, 78 mW, 20 mA, -40 to 85 degC, 2-Pin SMD, RoHS, Tape and Reel; Manufacturer: Avago; Forward Voltage: 3.4V; Power: 78mW; Forward Current: 20mA; Luminous Intensity: 55mcd; Lens Style: Diffused; Viewing Angle: 155degrees; Pins: 2; Max Operating Temperature: 85°C; Colour: Blue; Datasheet Version: Apr-10; RoHS Compliant: True; Mounting Technology: SM; Min Operating Temperature: -40°C; Illumination Colour: Blue; Package Quantity: 4000; Datasheet URL: http://docs.avagotech.com/docs/AV02-0977EN; Package Reference: HSMX-C190; Packaging: TapeandReel; Nominal Vf: 3.4V; Case/Package: 0603; Package Description: 2-Pin Surface Mount Device, Body 1.6 x 0.8 mm, Height 0.9 mm; Manufacturer URL: http://www.avagotech.com/
D2 = CMP-12792-000022-1: DIODE ZENER 15V 1W SMA; Manufacturer: Diodes; Forward Current: 200mA; Max Reverse Leakage Current: 1uA; Max Junction Temp: +150°C; Standoff Height: 0.05mm; Reverse Voltage: 11.4V; Zener Impedance: 10Ω; Max Zener Voltage: 15.75V; ComponentLink2URL: https://www.diodes.com/assets/Datasheets/ds18015.pdf; ComponentLink2Description: Datasheet; Nom Zener Voltage: 15V; Category: Diode; Device Class L2: Diodes; Lead Free: Yes; Power Dissipation: 1W; Automotive: No; Octopart: https://octopart.com/smaz15-13-f-diodes+inc.-334038; Temperature Range Low: -65°C; Temperature Range High: +150°C; Package: SMA; Temperature: -65°C to +150°C; Digikey Description: DIODE ZENER 15V 1W SMA; Manufacturer Part Number: SMAZ15-13-F; Mouser Description: Zener Diodes 15V 1W; Footprint Url: https://www.diodes.com/assets/Package-Files/SMA.pdf; Device Class L3: Zener Diodes; RoHS: TRUE; Device Class L1: Discrete Semiconductors; Height: 2.4mm
D3 = CMP-007-00012-2: LED Uni-Color Orange, 52 mW, 20 mA, -40 to 85 degC, 2-Pin SMD, RoHS, Tape and Reel; Manufacturer: Avago; Lens Style: Diffused; Forward Voltage: 2.2V; Forward Current: 20mA; Viewing Angle: 170degrees; Power: 52mW; Luminous Intensity: 8mcd; Min Operating Temperature: -40°C; Packaging: TapeandReel; Colour: Orange; Nominal Vf: 2.2V; Pins: 2; Case/Package: 0603; Max Operating Temperature: 85°C; Illumination Colour: Orange; Package Description: 2-Pin Surface Mount Device, Body 1.6 x 0.8 mm, Height 0.9 mm; Manufacturer URL: http://www.avagotech.com/; Datasheet Version: Mar-12; RoHS Compliant: True; Datasheet URL: http://docs.avagotech.com/docs/AV02-0551EN; Mounting Technology: SM; Package Reference: HSMX-C190; Package Quantity: 4000
J1 = CMP-008-000007-1: Manufacturer: Changzhou Amass Elec; Component Type: Standard; Pin Count: 2; Source: connectors.SchLib; Mnaufacturer Part Number: XT60PW-F; Datasheet Link: https://www.lcsc.com/datasheet/C428722.pdf; Design Item ID: XT60PW-F
L1 L2 = IND_2.2uH: 2.2uH Magnetic Shielded Inductor 7A SMD,12.3x12.3mm Fixed Inductors RoHS
Q1 = CMP-02550-000283-1: MOSFET P-CH 200V 9.4A PPAK SO-8; RoHS Compliant: Yes
R1 R4 R5 R8 R9 = RES_0603_100K: 100KΩ ±1% 0603 Thick Film Resistor; ComponentLink1Description: datasheet; ComponentLink1URL: https://www.lcsc.com/product-detail/C23025.html?s_z=n_resistance%2520300
R2 = RES_0603_523K: RES Thick Film, 523KΩ, 1%, 0.33W, 100ppm/°C, 0603; Max Power Dissipation: 250mW; Length: 0.063inch; Min Operating Temperature: -55°C; Contact Plating: Tin; Max Operating Temperature: 155°C; Number of Terminations: 2; Case/Package: 0603; Resistance: 523K; Height: 0.022inch; Package Quantity: 5000; Radiation Hardening: No; Composition: Thick Film; Tolerance: 1%; Temperature Coefficient: 100ppm/°C; Width: 0.033inch; Packaging: Tape and Reel; Features: Automotive AEC-Q200; Lead Free: Lead Free
R3 R7 = RES_0603_312K: Fixed Resistor, Thin Film, 0.1W, 2K, 75V, 0.1% +/-Tol, 25ppm/Cel, Surface Mount, 0603; Manufacturer: Yageo Group; Manufacturer Part Number: RT0603BRD07383KL; Manufacturer: 383kΩ; Max Power Dissipation: 100mW; Temperature Coefficient: 25ppm/°C; Supplier: Mouser; Supplier Part Number: 603-RT0603BRD07383KL; RoHS: Compliant; Category: Chip SMD Resistors; Stock: 416; Pricing: 1=0.18, 10=0.076, 50=0.076, 100=0.069, 1000=0.062, 10000=0.04 (USD); Case/Package: 0603; Case Code (Imperial): 0603; Case Code (Metric): 1608; China RoHS: Non-Compliant; Composition: Thin Film; Features: Moisture Resistant; Height: 450µm; Length: 1.6002mm; Lifecycle Status: Production; Max Operating Temperature: 155°C; Min Operating Temperature: -55°C; Mounting Technology: Surface Mount; Number of Terminals: 2; Number of Terminations: 2; Packaging: Tape & Reel; Power Dissipation: 100mW; Power Rating: 100mW; REACH SVHC: Yes; Termination: SMD/SMT; Tolerance: 0.1%; Voltage Rating: 75V; Width: 800µm; Working Voltage: 75V; ComponentLink1URL: https://datasheet.octopart.com:443/RT0603BRD07383KL-Yageo-datasheet-176402239.pdf?src-supplier=Future+Electronics; ComponentLink1Description: https://datasheet.octopart.com:443/RT0603BRD07383KL-Yageo-datasheet-176402239.pdf?src-supplier=Future+Electronics; ComponentLink2URL: https://datasheet.octopart.com:443/RT0603BRD07383KL-Yageo-datasheet-169971040.pdf?src-supplier=Future+Electronics; ComponentLink2Description: https://datasheet.octopart.com:443/RT0603BRD07383KL-Yageo-datasheet-169971040.pdf?src-supplier=Future+Electronics; ComponentLink3URL: https://datasheet.octopart.com:443/RT0603BRD07383KL-Yageo-datasheet-166250672.pdf?src-supplier=Future+Electronics; ComponentLink3Description: https://datasheet.octopart.com:443/RT0603BRD07383KL-Yageo-datasheet-166250672.pdf?src-supplier=Future+Electronics; ComponentLink4URL: https://datasheet.octopart.com:443/RT0603BRD07383KL-Yageo-datasheet-137700930.pdf?src-supplier=Future+Electronics; ComponentLink4Description: https://datasheet.octopart.com:443/RT0603BRD07383KL-Yageo-datasheet-137700930.pdf?src-supplier=Future+Electronics; ComponentLink5URL: https://datasheet.octopart.com:443/RT0603BRD07383KL-Yageo-datasheet-96443642.pdf?src-supplier=Upverter; ComponentLink5Description: https://datasheet.octopart.com:443/RT0603BRD07383KL-Yageo-datasheet-96443642.pdf?src-supplier=Upverter; ComponentLink6URL: https://datasheet.octopart.com/RT0603BRD07383KL-Yageo-datasheet-86813807.pdf; ComponentLink6Description: https://datasheet.octopart.com/RT0603BRD07383KL-Yageo-datasheet-86813807.pdf; ComponentLink7URL: http://sigma.octopart.com:80/conflict_mineral_statement/Yageo-company-3.pdf?src-supplier=Compliance+Statements; ComponentLink7Description: http://sigma.octopart.com:80/conflict_mineral_statement/Yageo-company-3.pdf?src-supplier=Compliance+Statements; ComponentLink8URL: http://sigma.octopart.com:80/rohs_statement/Yageo-company-2.pdf?src-supplier=Compliance+Statements; ComponentLink8Description: http://sigma.octopart.com:80/rohs_statement/Yageo-company-2.pdf?src-supplier=Compliance+Statements; Supplier: LCSC; Supplier Part Number: C861359; Datasheet Link: https://www.lcsc.com/datasheet/C861359.pdf
R6 = RES_0603_523K: RES Thick Film, 312KΩ, 1%, 0.33W, 100ppm/°C, 0603; Max Power Dissipation: 250mW; Resistance: 523K; Length: 0.063inch; Min Operating Temperature: -55°C; Contact Plating: Tin; Max Operating Temperature: 155°C; Number of Terminations: 2; Case/Package: 0603; Height: 0.022inch; Package Quantity: 5000; Radiation Hardening: No; Composition: Thick Film; Tolerance: 1%; Temperature Coefficient: 100ppm/°C; Width: 0.033inch; Packaging: Tape and Reel; Features: Automotive AEC-Q200; Lead Free: Lead Free
U1 U2 = TPS62130RGTR: 3-17V 3A Step-Down Converter with DCS-Control in 3x3 QFN Package; MF: Texas Instruments; SnapEDA_Link: https://www.snapeda.com/parts/TPS62130RGTR/Texas+Instruments/view-part/?ref=snap; Package: VQFN-16 Texas Instruments; Value: *; MP: TPS62130RGTR; Check_prices: https://www.snapeda.com/parts/TPS62130RGTR/Texas+Instruments/view-part/?ref=eda

## Sheet 04_MCU_ESP32.SchDoc
size A3; SheetNumber: 4; SheetTotal: 9
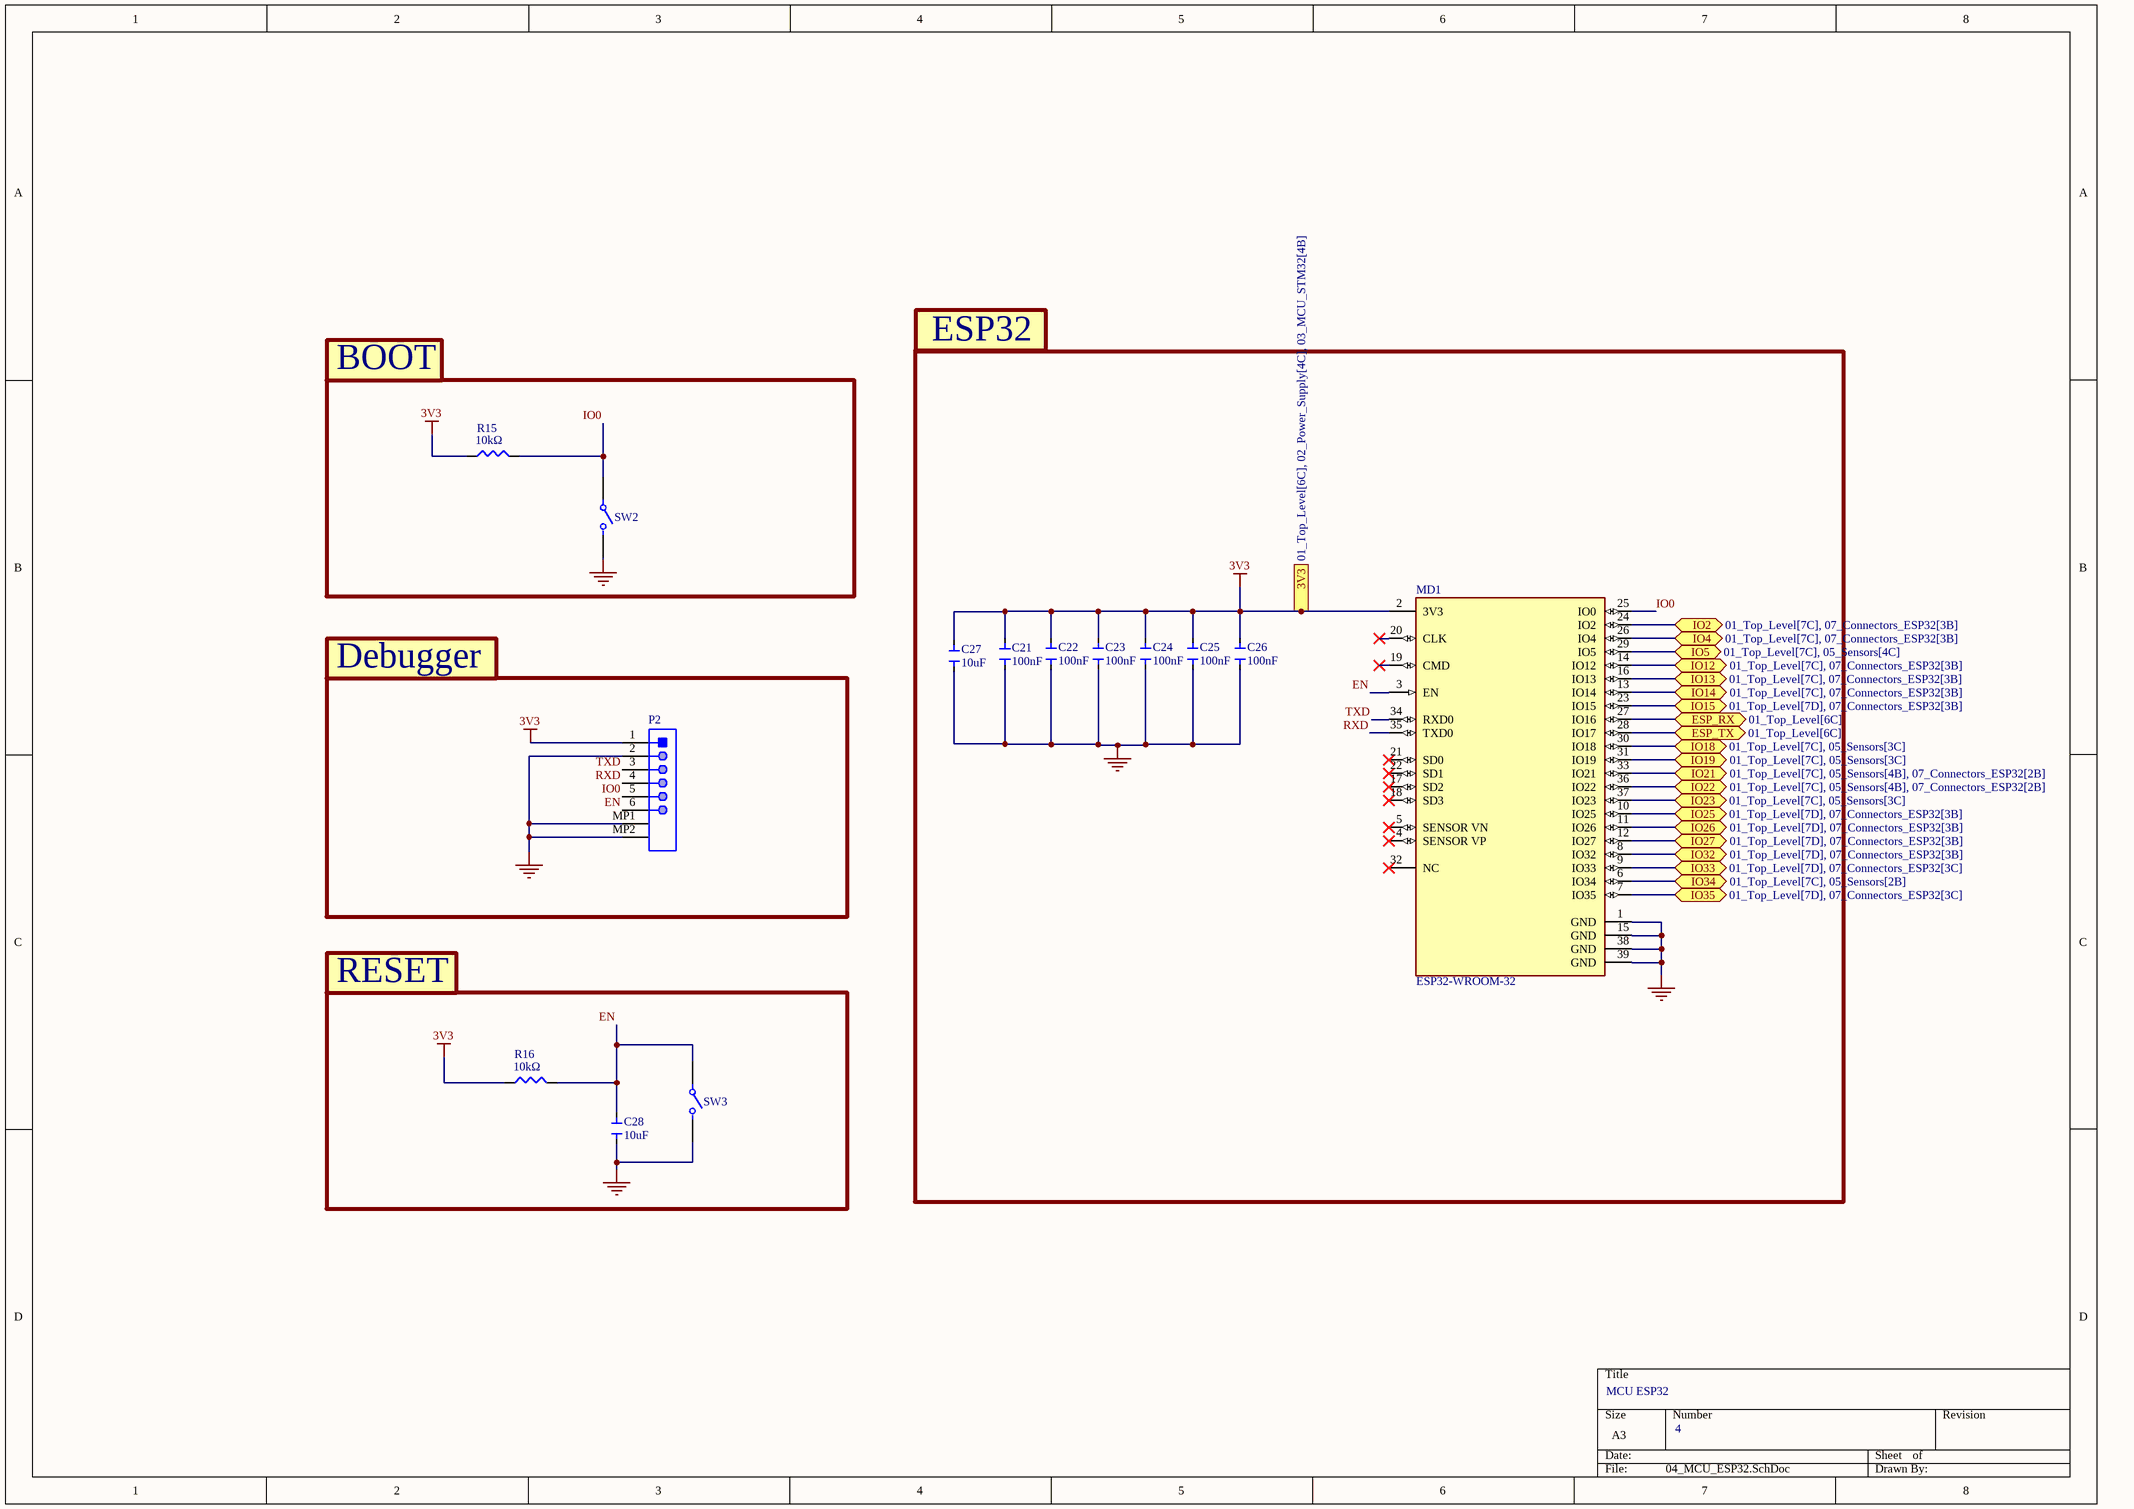
[diagram p3: 04_MCU_ESP32.SchDoc]

### Parts
C21  100nF  [CAP_100nF]
C22  100nF  [CAP_100nF]
C23  100nF  [CAP_100nF]
C24  100nF  [CAP_100nF]
C25  100nF  [CAP_100nF]
C26  100nF  [CAP_100nF]
C27  10uF  [CAP_10uF]
C28  10uF  [CAP_10uF]
MD1  ESP32-WROOM-32  [FP-ESP32-WROOM-32-MFG]
P2  SM06B-SRSS-TB(LF)(SN)  [JST-SM06B-SRSS-TB_V]  (value not drawn)
R15  10kΩ  [RES_10K]
R16  10kΩ  [RES_10K]
SW2  EVP-BD6C1A000  [FP-EVP-BD6C1A000-MFG]  (value not drawn)
SW3  EVP-BD6C1A000  [FP-EVP-BD6C1A000-MFG]  (value not drawn)

### Blocks framed on the sheet
BOOT: R15 SW2
ESP32: C21-C27 MD1
Debugger: P2
RESET: C28 R16 SW3

### Ports
3V3 (see 01_Top_Level[6C], 02_Power_Supply[4C], 03_MCU_STM32[4B]), ESP_RX (bidir, see 01_Top_Level[6C]), ESP_TX (bidir, see 01_Top_Level[6C]), IO2 (bidir, see 01_Top_Level[7C], 07_Connectors_ESP32[3B]), IO4 (bidir, see 01_Top_Level[7C], 07_Connectors_ESP32[3B]), IO5 (bidir, see 01_Top_Level[7C], 05_Sensors[4C]), IO12 (bidir, see 01_Top_Level[7C], 07_Connectors_ESP32[3B]), IO13 (bidir, see 01_Top_Level[7C], 07_Connectors_ESP32[3B]), IO14 (bidir, see 01_Top_Level[7C], 07_Connectors_ESP32[3B]), IO15 (bidir, see 01_Top_Level[7D], 07_Connectors_ESP32[3B]), IO18 (bidir, see 01_Top_Level[7C], 05_Sensors[3C]), IO19 (bidir, see 01_Top_Level[7C], 05_Sensors[3C]), IO21 (bidir, see 01_Top_Level[7C], 05_Sensors[4B], 07_Connectors_ESP32[2B]), IO22 (bidir, see 01_Top_Level[7C], 05_Sensors[4B], 07_Connectors_ESP32[2B]), IO23 (bidir, see 01_Top_Level[7C], 05_Sensors[3C]), IO25 (bidir, see 01_Top_Level[7D], 07_Connectors_ESP32[3B]), IO26 (bidir, see 01_Top_Level[7D], 07_Connectors_ESP32[3B]), IO27 (bidir, see 01_Top_Level[7D], 07_Connectors_ESP32[3B]), IO32 (bidir, see 01_Top_Level[7D], 07_Connectors_ESP32[3B]), IO33 (bidir, see 01_Top_Level[7D], 07_Connectors_ESP32[3C]), IO34 (bidir, see 01_Top_Level[7C], 05_Sensors[2B]), IO35 (bidir, see 01_Top_Level[7D], 07_Connectors_ESP32[3C])

### Nets
3V3: C21.2 C22.2 C23.2 C24.2 C25.2 C26.2 C27.2 MD1.2(3V3) P2.1 R15.1 R16.1 ; port 3V3
GND: C21.1 C22.1 C23.1 C24.1 C25.1 C26.1 C27.1 C28.2 MD1.1(GND) MD1.15(GND) MD1.38(GND) MD1.39(GND) P2.2 P2.MP1 P2.MP2 SW2.B SW3.B
EN: C28.1 MD1.3(EN) P2.6 R16.2 SW3.A
IO0: MD1.25(IO0) P2.5 R15.2 SW2.A
PA2: MD1.28(IO17) ; port ESP_TX
PA3: MD1.27(IO16) ; port ESP_RX
RXD: MD1.35(TXD0) P2.4
SCL: MD1.33(IO21) ; port IO21
SDA: MD1.36(IO22) ; port IO22
TXD: MD1.34(RXD0) P2.3
NetC31_2: MD1.6(IO34) ; port IO34
NetJ3_3: MD1.24(IO2) ; port IO2
NetJ3_4: MD1.26(IO4) ; port IO4
NetJ3_5: MD1.14(IO12) ; port IO12
NetJ3_6: MD1.16(IO13) ; port IO13
NetJ3_7: MD1.13(IO14) ; port IO14
NetJ3_8: MD1.23(IO15) ; port IO15
NetJ3_9: MD1.10(IO25) ; port IO25
NetJ3_10: MD1.11(IO26) ; port IO26
NetJ3_11: MD1.12(IO27) ; port IO27
NetJ3_12: MD1.8(IO32) ; port IO32
NetJ3_13: MD1.9(IO33) ; port IO33
NetJ3_14: MD1.7(IO35) ; port IO35
NetMD1_29: MD1.29(IO5) ; port IO5
NetMD1_30: MD1.30(IO18) ; port IO18
NetMD1_31: MD1.31(IO19) ; port IO19
NetMD1_37: MD1.37(IO23) ; port IO23

Not connected (* = marked no-connect by the designer): MD1 4(SENSOR_VP)* 5(SENSOR_VN)* 17(SD2)* 18(SD3)* 19(CMD)* 20(CLK)* 21(SD0)* 22(SD1)* 32(NC)*

### Notes on the sheet
- MCU ESP32
- 4

### Library data of the parts
C21-C26 = CAP_100nF: as C9 on sheet 03_MCU_STM32; value: 100nf; supplier: LCSC; supplier part number: C14663; ComponentLink1Description: Datasheet; ComponentLink1URL: https://www.lcsc.com/datasheet/C14663.pdf
C27 C28 = CAP_0402_10UF: as C17 on sheet 03_MCU_STM32; Supplier: LCSC; Supplier Part Number: 1276-6830-1-ND; RoHS: Yes; Category: Ceramic Capacitors; Stock: 1294909; Pricing: 1=0.33, 10=0.215, 50=0.1584, 100=0.129, 500=0.1018, 1000=0.08597, 2500=0.08145 (USD); Mounting Technology: Surface Mount; Pins: 2; Package Shape: Rectangular; Case/Package: 0402; Terminal Finish: Nickel; Min Operating Temperature: -55°C; Max Operating Temperature: 85°C; JESD-609 Code: e3; Value: 10uF; Capacitor Type: Ceramic; Packaging: Tape and Reel; Tolerance (fill in as +-): 20%; Rated DC Voltage (URdc): 10V; Temperature Characteristics Code: X5R; Termination: Wraparound; Reach SVHC Compliant: Yes; RoHS Compliant: Yes; ComponentLink1URL: https://datasheet.ciiva.com:443/pdfs/VipMasterIC/IC/SEMS/SEMS-S-A0008521219/SEMS-S-A0008521325-1.pdf?src-supplier=IHS+Markit; ComponentLink1Description: https://datasheet.ciiva.com:443/pdfs/VipMasterIC/IC/SEMS/SEMS-S-A0008521219/SEMS-S-A0008521325-1.pdf?src-supplier=IHS+Markit; ComponentLink2URL: http://www.samsungsem.com/kr/support/product-search/mlcc/CL05A106MP8NUB8.jsp?src-supplier=Digikey; ComponentLink2Description: http://www.samsungsem.com/kr/support/product-search/mlcc/CL05A106MP8NUB8.jsp?src-supplier=Digikey; ComponentLink3URL: https://datasheet.octopart.com/CL05A106MP8NUB8-Samsung-Electro-Mechanics-datasheet-136460857.pdf?src-supplier=Future+Electronics; ComponentLink3Description: https://datasheet.octopart.com/CL05A106MP8NUB8-Samsung-Electro-Mechanics-datasheet-136460857.pdf?src-supplier=Future+Electronics; LCSC Part Number: C307415
MD1 = CMP-194065-000008-1: RX TXRX MOD WIFI SURFACE MOUNT; Frequency: 2.5GHz; Sensitivity: -98dBm; Operating Supply Voltage: 3.6V; Data Rate: 150Mbps; Weight: 0.088185oz; Package Quantity: 550; Min Operating Temperature: -40°C; Mount: Surface Mount; Max Operating Temperature: 85°C; Packaging: Cut Tape; Case/Package: SMD/SMT
P2 = CMP-2000-07080-1: Male Header, Pitch 1 mm, 1 x 6 Position, Height 2.95 mm, -25 to 85 degC, RoHS, Tape and Reel; Manufacturer: JST; No of Positions: 6; Pitch: 1mm; Style/Orientation: RightAngleHeader/Plug; Datasheet URL: https://datasheet.ciiva.com/26894/getdatasheetpartid-708885-26894671.pdf; Package Description: Male Header, Pitch 1 mm, 1 X 6 Position, Height 2.9 mm; Termination: Solder; Manufacturer URL: http://www.jst.com/home2.html; Type: ShroudedHeader; Package Reference: SM06B-SRSS-TB; Datasheet Version: 11/2010; Mounting Technology: SurfaceMount
R15 R16 = RES_0603_10K: as R10 on sheet 03_MCU_STM32; Features: Moisture Resistant; Height: 450µm; Length: 1.6002mm; Lifecycle Status: Production; Max Operating Temperature: 155°C; Max Power Dissipation: 100mW; Min Operating Temperature: -55°C; Mounting Technology: Surface Mount; Number of Terminals: 2; Number of Terminations: 2; Packaging: Tape & Reel; Power Dissipation: 100mW; Power Rating: 100mW; REACH SVHC: Yes; Tolerance: 0.1%; Width: 800µm; Working Voltage: 75V; ComponentLink1URL: https://datasheet.octopart.com:443/RT0603BRB07169KL-Yageo-datasheet-176402239.pdf?src-supplier=IHS; ComponentLink1Description: https://datasheet.octopart.com:443/RT0603BRB07169KL-Yageo-datasheet-176402239.pdf?src-supplier=IHS; ComponentLink2URL: https://datasheet.octopart.com:443/RT0603BRB07169KL-Yageo-datasheet-96443642.pdf?src-supplier=Upverter; ComponentLink2Description: https://datasheet.octopart.com:443/RT0603BRB07169KL-Yageo-datasheet-96443642.pdf?src-supplier=Upverter; ComponentLink3URL: https://datasheet.octopart.com:443/RT0603BRB07169KL-Yageo-Group-datasheet-141265893.pdf?src-supplier=ODG+(Origin+Data+Global); ComponentLink3Description: https://datasheet.octopart.com:443/RT0603BRB07169KL-Yageo-Group-datasheet-141265893.pdf?src-supplier=ODG+(Origin+Data+Global); ComponentLink4URL: https://datasheet.octopart.com/RT0603BRB07169KL-Yageo-datasheet-86813807.pdf; ComponentLink4Description: https://datasheet.octopart.com/RT0603BRB07169KL-Yageo-datasheet-86813807.pdf; ComponentLink5URL: http://sigma.octopart.com:80/conflict_mineral_statement/Yageo-company-3.pdf?src-supplier=Compliance+Statements; ComponentLink5Description: http://sigma.octopart.com:80/conflict_mineral_statement/Yageo-company-3.pdf?src-supplier=Compliance+Statements; ComponentLink6URL: http://sigma.octopart.com:80/rohs_statement/Yageo-company-2.pdf?src-supplier=Compliance+Statements; ComponentLink6Description: http://sigma.octopart.com:80/rohs_statement/Yageo-company-2.pdf?src-supplier=Compliance+Statements; Supplier: LCSC; Supplier Part Number: C860143; Datasheet Link: https://www.lcsc.com/datasheet/C860143.pdf
SW2 SW3 = CMP-00287-74573419-1: as SW1 on sheet 03_MCU_STM32; Max Operating Temperature: 90°C; NexarPartId: 74573419; RoHS: Non-Compliant; Min Operating Temperature: -40°C; Height: 4.2mm; Operating Force: 3.5N; Mount: Surface Mount